# Altium project RK3588.PrjPcb (part 1 of 3)
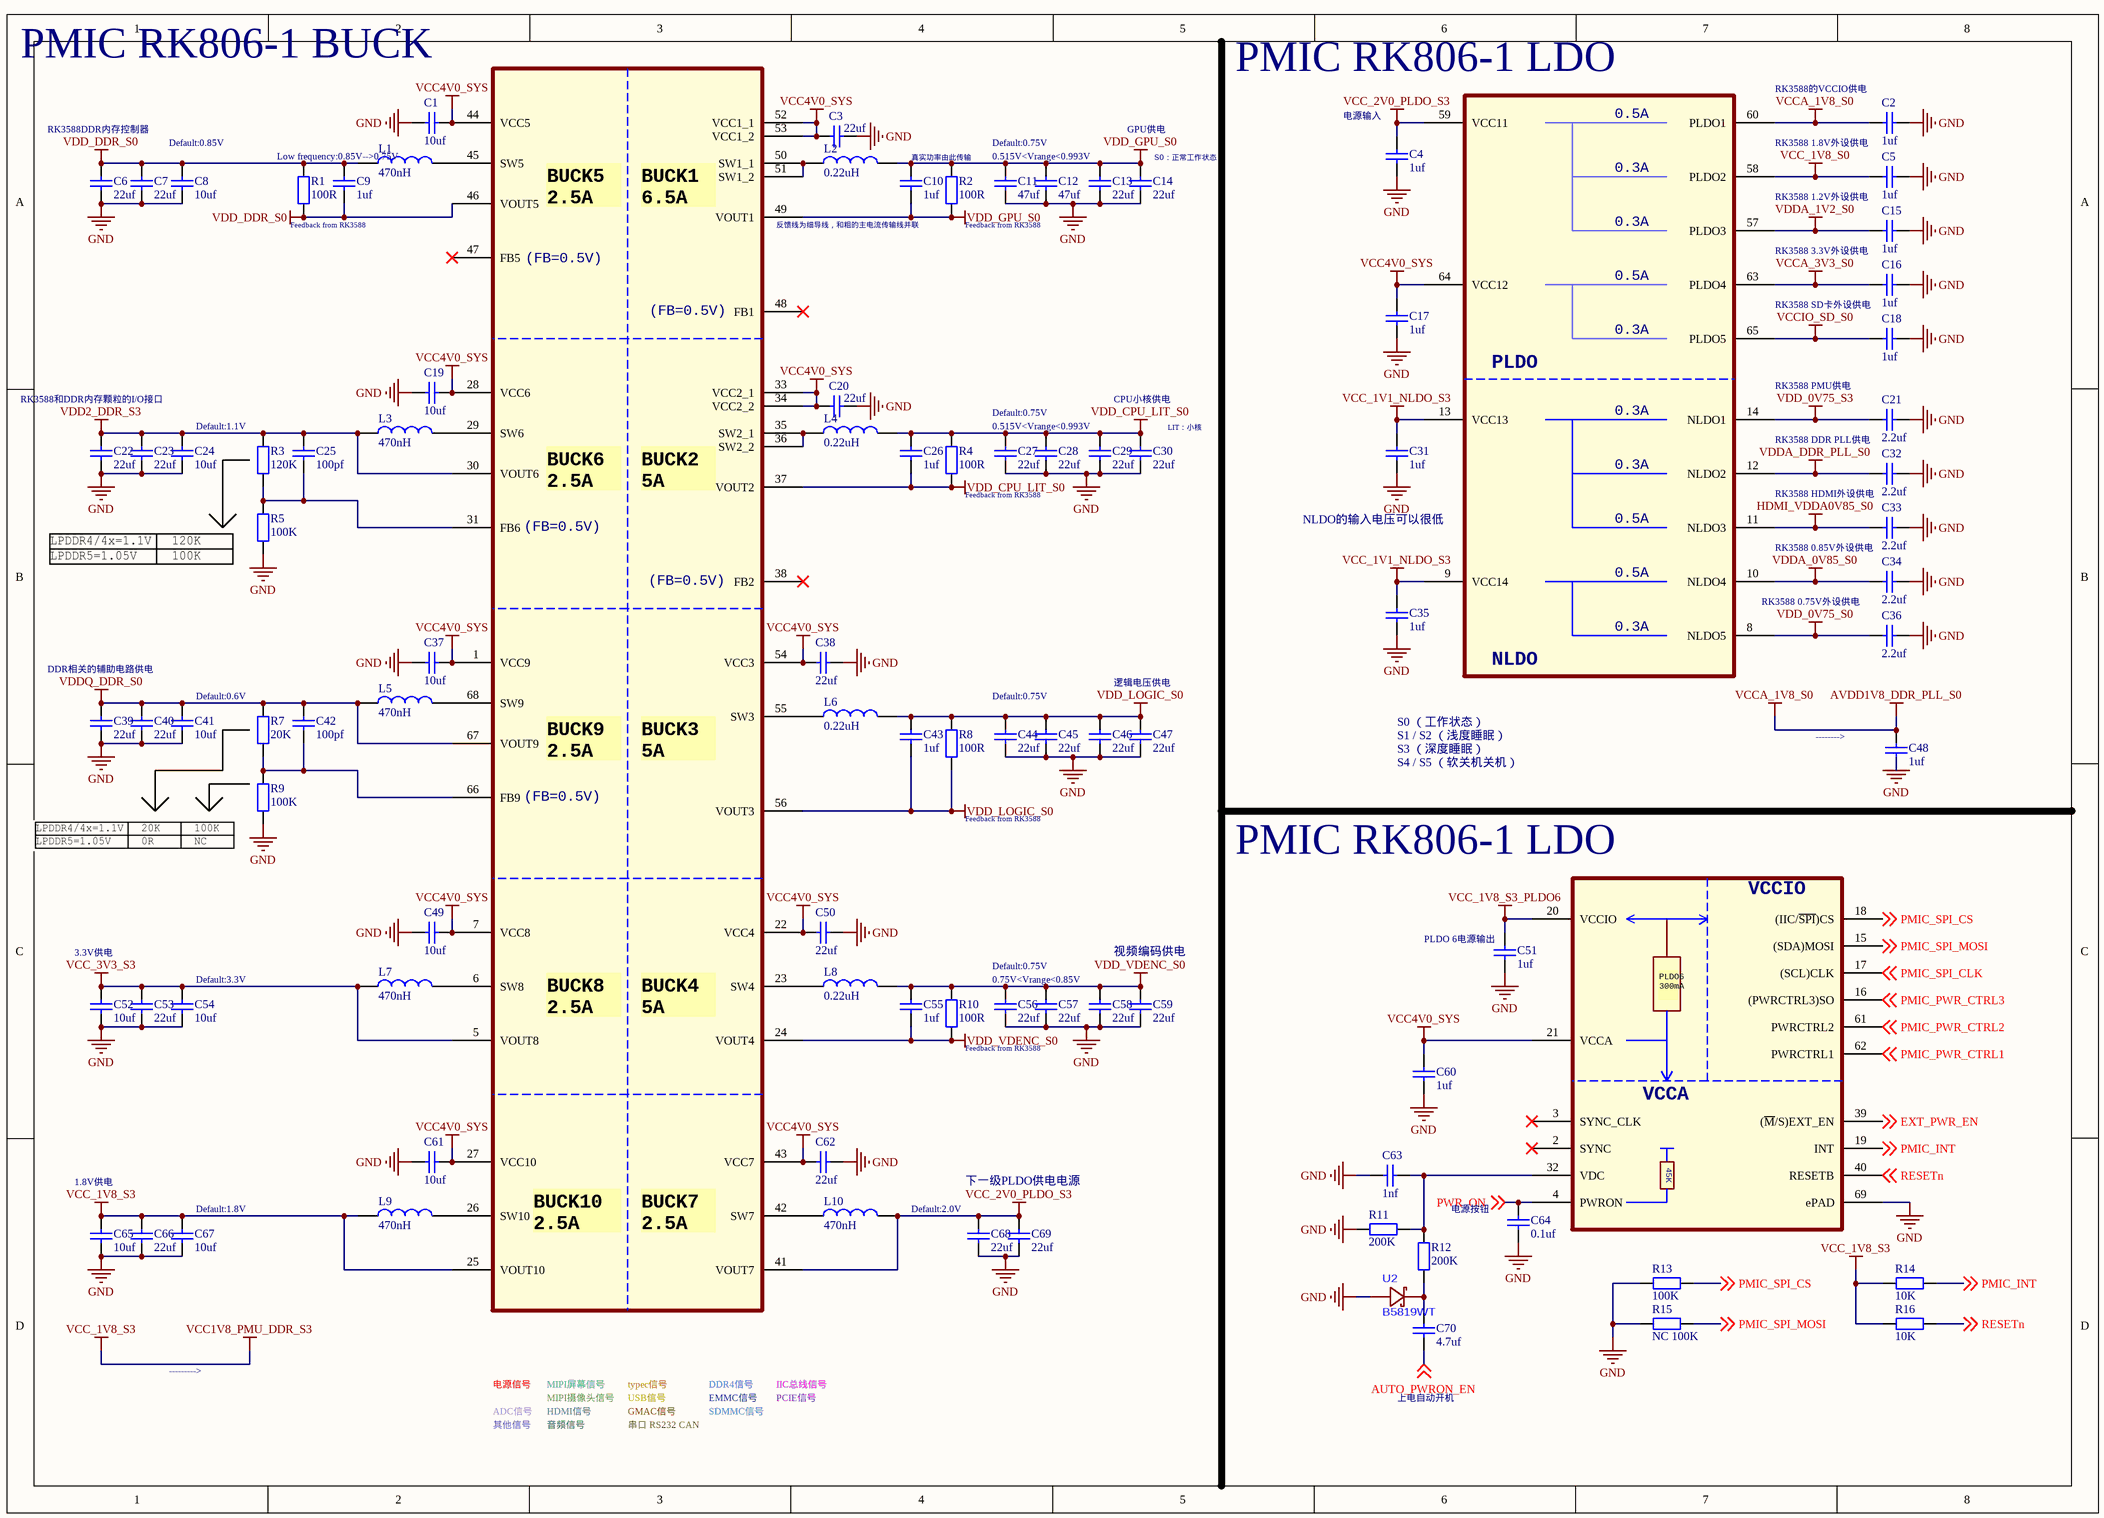
[diagram p0: 1.PMIC_1.SchDoc]
21 sheets, 570 parts. Net scope: global (net labels, ports and power ports of the same name join across sheets).
Board file: 0.PCB1.PcbDoc
Sheets:
  1.PMIC_1.SchDoc
  2.PMIC_2.SchDoc
  3.RK3588_POWER.SchDoc
  4.RK3588_GND.SchDoc
  5.RK3588_OSC_PLL_PMUIO1.SchDoc
  6.RK3588_PMUIO2.SchDoc
  7.RK3588_DDR_Controler.SchDoc
  8.RK3588_EMMCIO_VCCIO2.SchDoc
  9.RK3588_USB_Controler.SchDoc
  10.RK3588_VCCIO1_VCCIO3_SARADC.SchDoc
  11.RK3588_MIPI_D_C_PHY0_1.SchDoc
  12.RK3588_MIPI_CSI_HDMI2.1_HDMI.SchDoc
  13.RK3588_PCIE2.0_PCIE3.0.SchDoc
  14.RK3588_VCCIO4.SchDoc
  15.RK3588_VCCIO5.SchDoc
  16.RK3588_VCCIO6.SchDoc
  17.LPDDR4_LPDDR4x_1.SchDoc
  18.LPDDR4_LPDDR4x_2.SchDoc
  19.EMMC_FLASH.SchDoc
  20.BTB.SchDoc
  21.RK3588_CONFIG.SchDoc

## Sheet 1.PMIC_1.SchDoc
size A3; SheetNumber: 1; SheetTotal: 21

### Parts
C1  10uf  [C0603_L]
C2  1uf  [C0402_L]
C3  22uf  [C0603_L]
C4  1uf  [C0402_L]
C5  1uf  [C0402_L]
C6  22uf  [C0603_L]
C7  22uf  [C0603_L]
C8  10uf  [C0402_L]
C9  1uf  [C0402_L]
C10  1uf  [C0402_L]
C11  47uf  [C0805_L]
C12  47uf  [C0805_L]
C13  22uf  [C0603_L]
C14  22uf  [C0603_L]
C15  1uf  [C0402_L]
C16  1uf  [C0402_L]
C17  1uf  [C0402_L]
C18  1uf  [C0402_L]
C19  10uf  [C0603_L]
C20  22uf  [C0603_L]
C21  2.2uf  [C0402_L]
C22  22uf  [C0603_L]
C23  22uf  [C0603_L]
C24  10uf  [C0402_L]
C25  100pf  [C0402_L]
C26  1uf  [C0402_L]
C27  22uf  [C0603_L]
C28  22uf  [C0603_L]
C29  22uf  [C0603_L]
C30  22uf  [C0603_L]
C31  1uf  [C0402_L]
C32  2.2uf  [C0402_L]
C33  2.2uf  [C0402_L]
C34  2.2uf  [C0402_L]
C35  1uf  [C0402_L]
C36  2.2uf  [C0402_L]
C37  10uf  [C0603_L]
C38  22uf  [C0603_L]
C39  22uf  [C0603_L]
C40  22uf  [C0603_L]
C41  10uf  [C0402_L]
C42  100pf  [C0402_L]
C43  1uf  [C0402_L]
C44  22uf  [C0805_L]
C45  22uf  [C0805_L]
C46  22uf  [C0603_L]
C47  22uf  [C0603_L]
C48  1uf  [C0402_L]
C49  10uf  [C0603_L]
C50  22uf  [C0603_L]
C51  1uf  [C0402_L]
C52  10uf  [C0603_L]
C53  22uf  [C0603_L]
C54  10uf  [C0402_L]
C55  1uf  [C0402_L]
C56  22uf  [C0805_L]
C57  22uf  [C0805_L]
C58  22uf  [C0603_L]
C59  22uf  [C0603_L]
C60  1uf  [C0402_L]
C61  10uf  [C0603_L]
C62  22uf  [C0603_L]
C63  1nf  [C0402_L]
C64  0.1uf  [C0402_L]
C65  10uf  [C0603_L]
C66  22uf  [C0603_L]
C67  10uf  [C0402_L]
C68  22uf  [C0603_L]
C69  22uf  [C0603_L]
C70  4.7uf  [C0402_L]
L1  470nH  [L0805]
L2  0.22uH  [L0805]
L3  470nH  [L0805]
L4  0.22uH  [L0805]
L5  470nH  [L0805]
L6  0.22uH  [L0805]
L7  470nH  [L0805]
L8  0.22uH  [L0805]
L9  470nH  [L0805]
L10  470nH  [L0805]
R1  100R  [R0402_L]
R2  100R  [R0402_L]
R3  120K  [R0402_L]
R4  100R  [R0402_L]
R5  100K  [R0402_L]
R7  20K  [R0402_L]
R8  100R  [R0402_L]
R9  100K  [R0402_L]
R10  100R  [R0402_L]
R11  200K  [R0402_L]
R12  200K  [R0402_L]
R13  100K  [R0402_L]
R14  10K  [R0402_L]
R15  NC 100K  [R0402_L]
R16  10K  [R0402_L]
U1  PMIC_RK806  [QFN68_7R00X7R00X0R80_T]  (value not drawn)  (parts A,B,C of 3)
U2  B5819WT  [SOD-523_L1.2-W0.8-LS1.6-RD]

### Nets
AVDD1V8_DDR_PLL_S0: C2.2 C48.1 U1.60(PLDO1)  [also labelled VCCA_1V8_S0]
GND: C1.2 C2.1 C3.2 C4.1 C5.1 C6.1 C7.1 C8.1 C11.1 C12.1 C13.1 C14.1 C15.1 C16.1 C17.1 C18.1 C19.2 C20.2 C21.1 C22.1 C23.1 C24.1 C27.1 C28.1 C29.1 C30.1 C31.1 C32.1 C33.1 C34.1 C35.1 C36.1 C37.2 C38.2 C39.1 C40.1 C41.1 C44.1 C45.1 C46.1 C47.1 C48.2 C49.2 C50.2 C51.1 C52.1 C53.1 C54.1 C56.1 C57.1 C58.1 C59.1 C60.1 C61.2 C62.2 C63.1 C64.1 C65.1 C66.1 C67.1 C68.1 C69.1 R5.1 R9.1 R11.1 R13.1 R15.1 U1.69(ePAD) U2.2(A)
HDMI_VDDA0V85_S0: C33.2 U1.11(NLDO3)
VCC1V8_PMU_DDR_S3: C65.2 C66.2 C67.2 L9.2 R14.1 R16.1 U1.25(VOUT10)  [also labelled VCC_1V8_S3]
VCC4V0_SYS: C1.1 C3.1 C17.2 C19.1 C20.1 C37.1 C38.1 C49.1 C50.1 C60.2 C61.1 C62.1 U1.1(VCC9) U1.7(VCC8) U1.21(VCCA) U1.22(VCC4) U1.27(VCC10) U1.28(VCC6) U1.33(VCC2_1) U1.34(VCC2_2) U1.43(VCC7) U1.44(VCC5) U1.52(VCC1_1) U1.53(VCC1_2) U1.54(VCC3) U1.64(VCC12)
VCC_1V1_NLDO_S3: C31.2 C35.2 U1.9(VCC14) U1.13(VCC13)
VCC_1V8_S0: C5.2 U1.58(PLDO2)
VCC_1V8_S3_PLDO6: C51.2 U1.20(VCCIO)
VCC_2V0_PLDO_S3: C4.2 C68.2 C69.2 L10.2 U1.41(VOUT7) U1.59(VCC11)
VCC_3V3_S3: C52.2 C53.2 C54.2 L7.2 U1.5(VOUT8)
VCCA_3V3_S0: C16.2 U1.63(PLDO4)
VCCIO_SD_S0: C18.2 U1.65(PLDO5)
VDD2_DDR_S3: C22.2 C23.2 C24.2 C25.2 L3.2 R3.2 U1.30(VOUT6)
VDD_0V75_S0: C36.2 U1.8(NLDO5)
VDD_0V75_S3: C21.2 U1.14(NLDO1)
VDD_CPU_LIT_S0: C26.1 C26.2 C27.2 C28.2 C29.2 C30.2 L4.2 R4.1 R4.2 U1.37(VOUT2)
VDD_DDR_S0: C6.2 C7.2 C8.2 C9.1 C9.2 L1.2 R1.1 R1.2 U1.46(VOUT5)
VDD_GPU_S0: C10.1 C10.2 C11.2 C12.2 C13.2 C14.2 L2.2 R2.1 R2.2 U1.49(VOUT1)
VDD_LOGIC_S0: C43.1 C43.2 C44.2 C45.2 C46.2 C47.2 L6.2 R8.1 R8.2 U1.56(VOUT3)
VDD_VDENC_S0: C55.1 C55.2 C56.2 C57.2 C58.2 C59.2 L8.2 R10.1 R10.2 U1.24(VOUT4)
VDDA_0V85_S0: C34.2 U1.10(NLDO4)
VDDA_1V2_S0: C15.2 U1.57(PLDO3)
VDDA_DDR_PLL_S0: C32.2 U1.12(NLDO2)
VDDQ_DDR_S0: C39.2 C40.2 C41.2 C42.2 L5.2 R7.2 U1.67(VOUT9)  [project net VDDQ_DDR]
AUTO_PWRON_EN: C70.2 ; off-sheet AUTO_PWRON_EN
EXT_PWR_EN: U1.39((~{M}/S)EXT_EN) ; off-sheet EXT_PWR_EN
PMIC_INT: R14.2 U1.19(INT) ; off-sheet PMIC_INT
PMIC_PWR_CTRL1: U1.62(PWRCTRL1) ; off-sheet PMIC_PWR_CTRL1
PMIC_PWR_CTRL2: U1.61(PWRCTRL2) ; off-sheet PMIC_PWR_CTRL2
PMIC_PWR_CTRL3: U1.16((PWRCTRL3)SO) ; off-sheet PMIC_PWR_CTRL3
PMIC_SPI_CLK: U1.17((SCL)CLK) ; off-sheet PMIC_SPI_CLK
PMIC_SPI_CS: R13.2 U1.18((IIC/~{SPI})CS) ; off-sheet PMIC_SPI_CS
PMIC_SPI_MOSI: R15.2 U1.15((SDA)MOSI) ; off-sheet PMIC_SPI_MOSI
PWR_ON: C64.2 U1.4(PWRON) ; off-sheet PWR_ON
RESETn: R16.2 U1.40(RESETB) ; off-sheet RESETn
NetC25_1: C25.1 R3.1 R5.2 U1.31(FB6)
NetC42_1: C42.1 R7.1 R9.2 U1.66(FB9)
NetC63_2: C63.2 R11.2 R12.2 U1.32(VDC)
NetC70_1: C70.1 R12.1 U2.1(C)
NetL1_1: L1.1 U1.45(SW5)
NetL2_1: L2.1 U1.50(SW1_1) U1.51(SW1_2)
NetL3_1: L3.1 U1.29(SW6)
NetL4_1: L4.1 U1.35(SW2_1) U1.36(SW2_2)
NetL5_1: L5.1 U1.68(SW9)
NetL6_1: L6.1 U1.55(SW3)
NetL7_1: L7.1 U1.6(SW8)
NetL8_1: L8.1 U1.23(SW4)
NetL9_1: L9.1 U1.26(SW10)
NetL10_1: L10.1 U1.42(SW7)

Not connected (* = marked no-connect by the designer): U1 2(SYNC)* 3(SYNC_CLK)* 38(FB2)* 47(FB5)* 48(FB1)*

### Notes on the sheet
- PMIC RK806-1 BUCK
- (near U1) PMIC RK806-1 LDO
- (near C4) 电源输入
- RK3588的VCCIO供电
- RK3588DDR内存控制器
- Default:0.85V
- Low frequency:0.85V-->0.75V
- 真实功率由此传输
- Default:0.75V
- 0.515V<Vrange<0.993V
- GPU供电
- (near C14) S0​：正常工作状态
- RK3588 1.8V外设供电
- (near R1) Feedback from RK3588
- (near U1) 反馈线为细导线，和粗的主电流传输线并联
- Feedback from RK3588
- RK3588 1.2V外设供电
- RK3588 3.3V外设供电
- RK3588 SD卡外设供电
- RK3588 PMU供电
- RK3588和DDR内存颗粒的I/O接口
- Default:1.1V
- CPU小核供电
- (near C30) LIT：小核
- RK3588 DDR PLL供电
- NLDO的输入电压可以很低
- RK3588 HDMI外设供电
- RK3588 0.85V外设供电
- (near U1) RK3588 0.75V外设供电
- DDR相关的辅助电路供电
- Default:0.6V
- 逻辑电压供电
- S0 （工作状态）
- S1 / S2 （浅度睡眠）
- S3 （深度睡眠）
- S4 / S5 （软关机关机）
- (near C48) -------->
- PMIC RK806-1 LDO
- 3.3V供电
- (near C54) Default:3.3V
- 0.75V<Vrange<0.85V
- 视频编码供电
- (near C51) PLDO 6电源输出
- 1.8V供电
- 下一级PLDO供电电源
- (near C67) Default:1.8V
- (near C68) Default:2.0V
- 电源按钮
- --------->
- 电源信号
- MIPI屏幕信号
- MIPI摄像头信号
- typec信号
- USB信号
- DDR4信号
- EMMC信号
- PCIE信号
- IIC总线信号
- 上电自动开机
- 其他信号
- ADC信号
- 音频信号
- HDMI信号
- 串口 RS232 CAN
- GMAC信号
- SDMMC信号
- (in symbol PMIC_RK806, part A) BUCK5 / 2.5A; BUCK1 / 6.5A; (FB=0.5V); BUCK6 / 2.5A; BUCK2 / 5A; BUCK9 / 2.5A; BUCK3 / 5A; BUCK8 / 2.5A; BUCK4 / 5A; BUCK10 / 2.5A; BUCK7 / 2.5A
- (in symbol PMIC_RK806, part B) 0.5A; 0.3A; PLDO; NLDO
- (in symbol PMIC_RK806, part C) PLDO6 / 300mA; 45K

### Library data of the parts
C1-C70 = C: 贴片电容/MLCC电容
L1-L10 = L: 贴片小功率电感
R1-R5 R7-R16 = R: 贴片电阻

## Sheet 2.PMIC_2.SchDoc
size A4; SheetNumber: 2; SheetTotal: 21
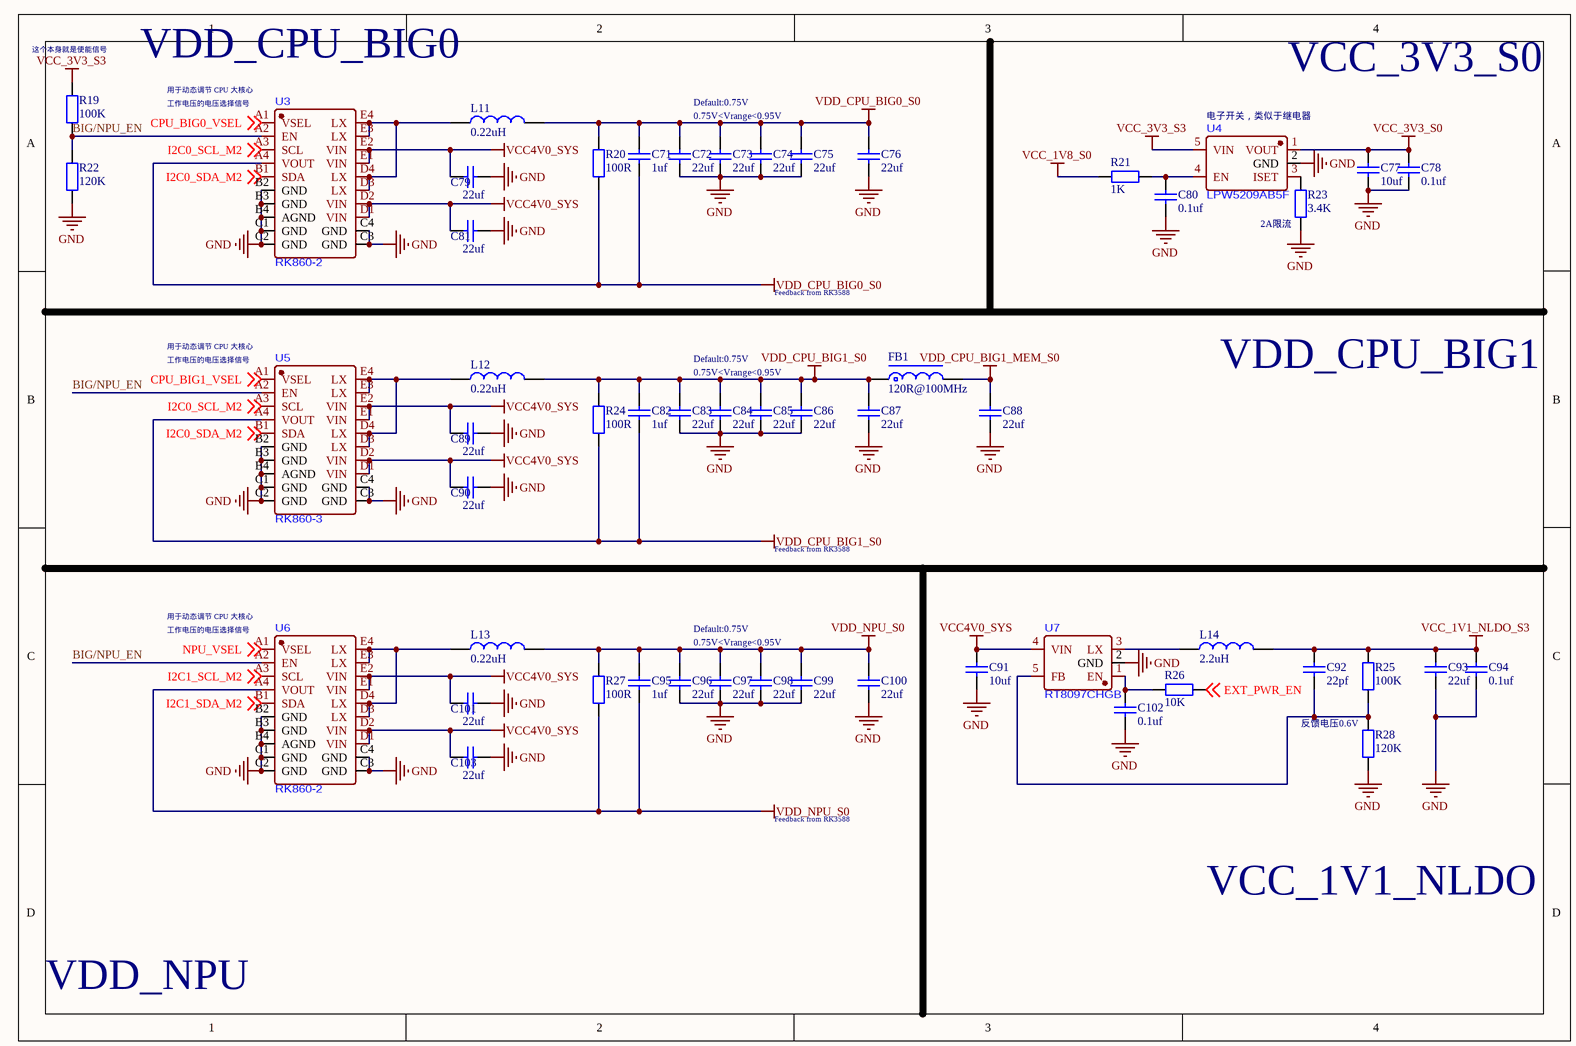
[diagram p1: 2.PMIC_2.SchDoc]

### Parts
C71  1uf  [C0402_L]
C72  22uf  [C0603_L]
C73  22uf  [C0603_L]
C74  22uf  [C0603_L]
C75  22uf  [C0603_L]
C76  22uf  [C0603_L]
C77  10uf  [C0402_L]
C78  0.1uf  [C0402_L]
C79  22uf  [C0603_L]
C80  0.1uf  [C0402_L]
C81  22uf  [C0603_L]
C82  1uf  [C0402_L]
C83  22uf  [C0603_L]
C84  22uf  [C0603_L]
C85  22uf  [C0603_L]
C86  22uf  [C0603_L]
C87  22uf  [C0603_L]
C88  22uf  [C0603_L]
C89  22uf  [C0603_L]
C90  22uf  [C0603_L]
C91  10uf  [C0402_L]
C92  22pf  [C0402_L]
C93  22uf  [C0603_L]
C94  0.1uf  [C0402_L]
C95  1uf  [C0402_L]
C96  22uf  [C0603_L]
C97  22uf  [C0603_L]
C98  22uf  [C0603_L]
C99  22uf  [C0603_L]
C100  22uf  [C0603_L]
C101  22uf  [C0603_L]
C102  0.1uf  [C0402_L]
C103  22uf  [C0603_L]
FB1  120R@100MHz  [FB0402]
L11  0.22uH  [L0805]
L12  0.22uH  [L0805]
L13  0.22uH  [L0805]
L14  2.2uH  [L0805]
R19  100K  [R0402_L]
R20  100R  [R0402_L]
R21  1K  [R0402_L]
R22  120K  [R0402_L]
R23  3.4K  [R0402_L]
R24  100R  [R0402_L]
R25  100K  [R0402_L]
R26  10K  [R0402_L]
R27  100R  [R0402_L]
R28  120K  [R0402_L]
U3  RK860-2  [WLCSP-20_L2.0-W1.6-R5-C4-P0.40-TL]
U4  LPW5209AB5F  [SOT-23-5_L3.0-W1.7-P0.95-LS2.8-BL]
U5  RK860-3  [WLCSP-20_L2.0-W1.6-R5-C4-P0.40-TL]
U6  RK860-2  [WLCSP-20_L2.0-W1.6-R5-C4-P0.40-TL]
U7  RT8097CHGB  [SOT-23-5_L3.0-W1.7-P0.95-LS2.8-BR]

### Nets
GND: C72.1 C73.1 C74.1 C75.1 C76.1 C77.1 C78.1 C79.1 C80.1 C81.1 C83.1 C84.1 C85.1 C86.1 C87.1 C88.1 C89.1 C90.1 C91.2 C93.1 C94.1 C96.1 C97.1 C98.1 C99.1 C100.1 C101.1 C102.1 C103.1 R22.1 R23.1 R28.1 U3.B2(GND) U3.B3(GND) U3.B4(AGND) U3.C1(GND) U3.C2(GND) U3.C3(GND) U3.C4(GND) U4.2(GND) U5.B2(GND) U5.B3(GND) U5.B4(AGND) U5.C1(GND) U5.C2(GND) U5.C3(GND) U5.C4(GND) U6.B2(GND) U6.B3(GND) U6.B4(AGND) U6.C1(GND) U6.C2(GND) U6.C3(GND) U6.C4(GND) U7.2(GND)
VCC4V0_SYS: C79.2 C81.2 C89.2 C90.2 C91.1 C101.2 C103.2 U3.D1(VIN) U3.D2(VIN) U3.E1(VIN) U3.E2(VIN) U5.D1(VIN) U5.D2(VIN) U5.E1(VIN) U5.E2(VIN) U6.D1(VIN) U6.D2(VIN) U6.E1(VIN) U6.E2(VIN) U7.4(VIN)
VCC_1V1_NLDO_S3: C92.2 C93.2 C94.2 L14.2 R25.2
VCC_1V8_S0: R21.1
VCC_3V3_S0: C77.2 C78.2 U4.1(VOUT)
VCC_3V3_S3: R19.2 U4.5(VIN)
VDD_CPU_BIG0_S0: C71.1 C71.2 C72.2 C73.2 C74.2 C75.2 C76.2 L11.2 R20.1 R20.2 U3.A4(VOUT)
VDD_CPU_BIG1_MEM_S0: C88.2 FB1.2
VDD_CPU_BIG1_S0: C82.1 C82.2 C83.2 C84.2 C85.2 C86.2 C87.2 FB1.1 L12.2 R24.1 R24.2 U5.A4(VOUT)
VDD_NPU_S0: C95.1 C95.2 C96.2 C97.2 C98.2 C99.2 C100.2 L13.2 R27.1 R27.2 U6.A4(VOUT)
BIG/NPU_EN: R19.1 R22.2 U3.A2(EN) U5.A2(EN) U6.A2(EN)
CPU_BIG0_VSEL: U3.A1(VSEL) ; off-sheet CPU_BIG0_VSEL
CPU_BIG1_VSEL: U5.A1(VSEL) ; off-sheet CPU_BIG1_VSEL
EXT_PWR_EN: R26.2 ; off-sheet EXT_PWR_EN
I2C0_SCL_M2: U3.A3(SCL) U5.A3(SCL) ; off-sheet I2C0_SCL_M2
I2C0_SDA_M2: U3.B1(SDA) U5.B1(SDA) ; off-sheet I2C0_SDA_M2
I2C1_SCL_M2: U6.A3(SCL) ; off-sheet I2C1_SCL_M2
I2C1_SDA_M2: U6.B1(SDA) ; off-sheet I2C1_SDA_M2
NPU_VSEL: U6.A1(VSEL) ; off-sheet NPU_VSEL
NetC80_2: C80.2 R21.2 U4.4(EN)
NetC92_1: C92.1 R25.1 R28.2 U7.5(FB)
NetC102_2: C102.2 R26.1 U7.1(EN)
NetL11_1: L11.1 U3.D3(LX) U3.D4(LX) U3.E3(LX) U3.E4(LX)
NetL12_1: L12.1 U5.D3(LX) U5.D4(LX) U5.E3(LX) U5.E4(LX)
NetL13_1: L13.1 U6.D3(LX) U6.D4(LX) U6.E3(LX) U6.E4(LX)
NetL14_1: L14.1 U7.3(LX)
NetR23_2: R23.2 U4.3(ISET)

### Notes on the sheet
- (near R19) 这个本身就是使能信号
- VDD_CPU_BIG0
- 用于动态调节 CPU 大核心
- 工作电压的电压选择信号
- Default:0.75V
- 0.75V<Vrange<0.95V
- (near U4) 电子开关，类似于继电器
- VCC_3V3_S0
- (near R23) 2A限流
- Feedback from RK3588
- VDD_CPU_BIG1
- 反馈电压0.6V
- VCC_1V1_NLDO
- VDD_NPU

### Library data of the parts
C71-C103 = C: 贴片电容/MLCC电容
FB1 = FB: 贴片磁珠
L11-L14 = L: 贴片小功率电感
R19-R28 = R: 贴片电阻

## Sheet 3.RK3588_POWER.SchDoc
size A4; SheetNumber: 3; SheetTotal: 21
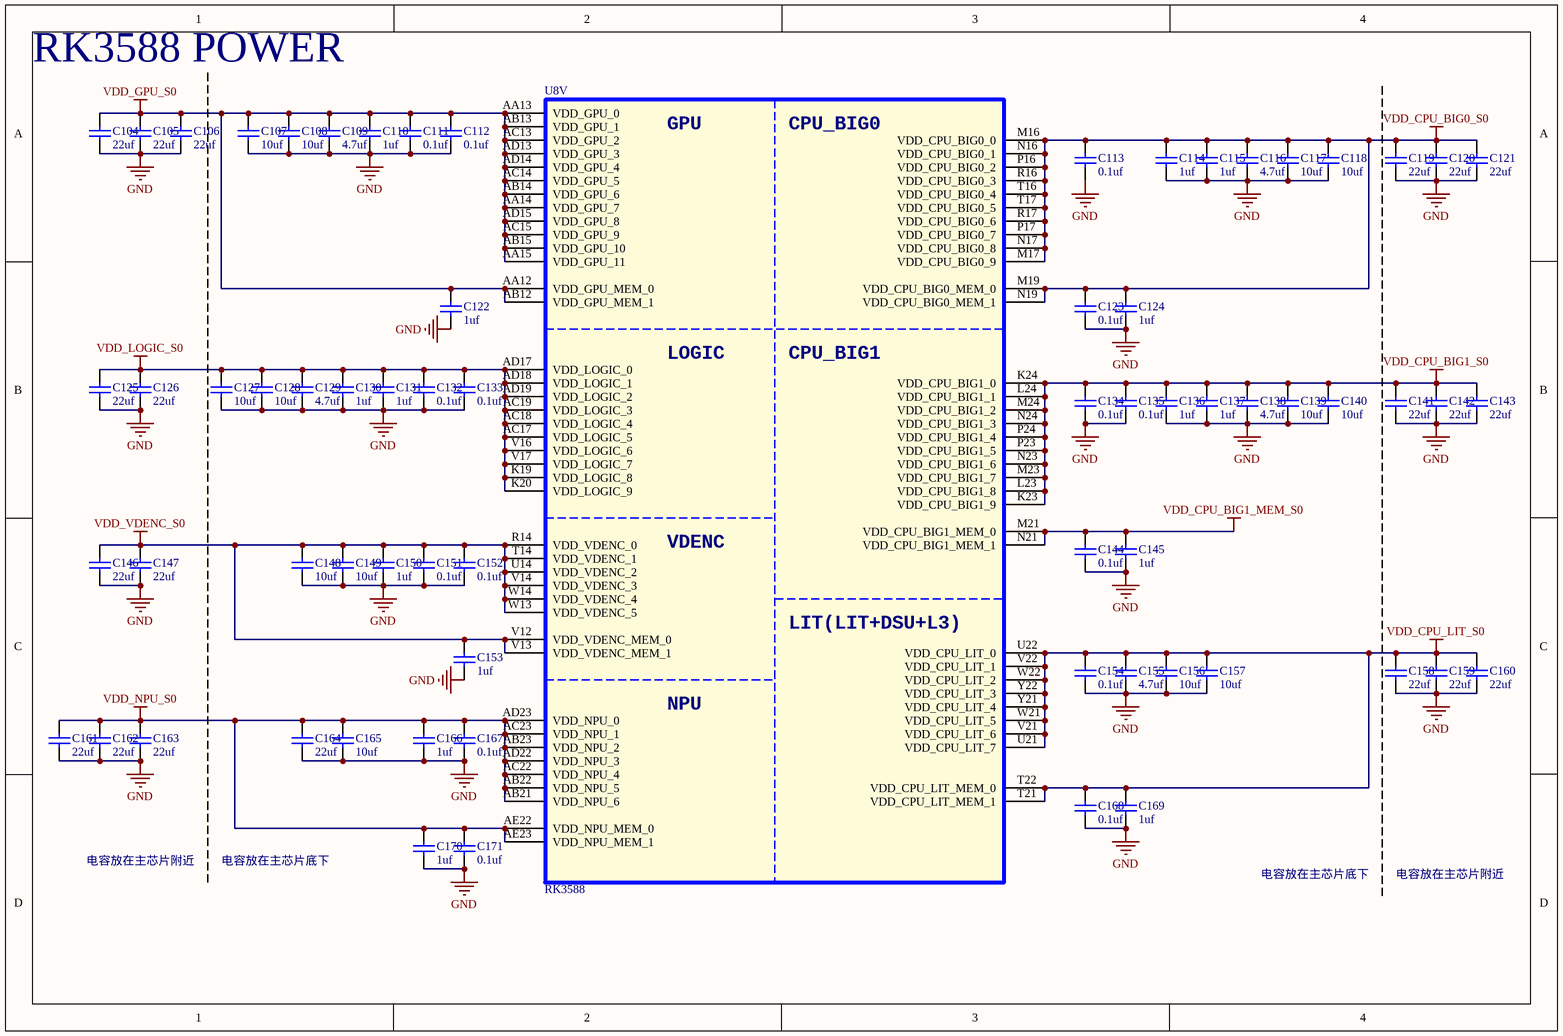
[diagram p2: 3.RK3588_POWER.SchDoc]

### Parts
C104  22uf  [C0603_L]
C105  22uf  [C0603_L]
C106  22uf  [C0603_L]
C107  10uf  [C0402_L]
C108  10uf  [C0402_L]
C109  4.7uf  [C0402_L]
C110  1uf  [C0201_L]
C111  0.1uf  [C0201_L]
C112  0.1uf  [C0201_L]
C113  0.1uf  [C0201_L]
C114  1uf  [C0201_L]
C115  1uf  [C0201_L]
C116  4.7uf  [C0201_L]
C117  10uf  [C0402_L]
C118  10uf  [C0402_L]
C119  22uf  [C0603_L]
C120  22uf  [C0603_L]
C121  22uf  [C0603_L]
C122  1uf  [C0201_L]
C123  0.1uf  [C0201_L]
C124  1uf  [C0201_L]
C125  22uf  [C0603_L]
C126  22uf  [C0603_L]
C127  10uf  [C0402_L]
C128  10uf  [C0402_L]
C129  4.7uf  [C0402_L]
C130  1uf  [C0201_L]
C131  1uf  [C0201_L]
C132  0.1uf  [C0201_L]
C133  0.1uf  [C0201_L]
C134  0.1uf  [C0201_L]
C135  0.1uf  [C0201_L]
C136  1uf  [C0201_L]
C137  1uf  [C0201_L]
C138  4.7uf  [C0402_L]
C139  10uf  [C0402_L]
C140  10uf  [C0402_L]
C141  22uf  [C0603_L]
C142  22uf  [C0603_L]
C143  22uf  [C0603_L]
C144  0.1uf  [C0201_L]
C145  1uf  [C0201_L]
C146  22uf  [C0603_L]
C147  22uf  [C0603_L]
C148  10uf  [C0402_L]
C149  10uf  [C0402_L]
C150  1uf  [C0201_L]
C151  0.1uf  [C0201_L]
C152  0.1uf  [C0201_L]
C153  1uf  [C0201_L]
C154  0.1uf  [C0201_L]
C155  4.7uf  [C0402_L]
C156  10uf  [C0402_L]
C157  10uf  [C0402_L]
C158  22uf  [C0603_L]
C159  22uf  [C0603_L]
C160  22uf  [C0603_L]
C161  22uf  [C0603_L]
C162  22uf  [C0603_L]
C163  22uf  [C0603_L]
C164  22uf  [C0402_L]
C165  10uf  [C0402_L]
C166  1uf  [C0201_L]
C167  0.1uf  [C0201_L]
C168  0.1uf  [C0201_L]
C169  1uf  [C0201_L]
C170  1uf  [C0201_L]
C171  0.1uf  [C0201_L]
U8  RK3588  [BGA1088_23R00X23R00X2R00]  (part V of 26)

### Nets
GND: C104.1 C105.1 C106.1 C107.1 C108.1 C109.1 C110.1 C111.1 C112.1 C113.1 C114.1 C115.1 C116.1 C117.1 C118.1 C119.1 C120.1 C121.1 C122.1 C123.1 C124.1 C125.1 C126.1 C127.1 C128.1 C129.1 C130.1 C131.1 C132.1 C133.1 C134.1 C135.1 C136.1 C137.1 C138.1 C139.1 C140.1 C141.1 C142.1 C143.1 C144.1 C145.1 C146.1 C147.1 C148.1 C149.1 C150.1 C151.1 C152.1 C153.1 C154.1 C155.1 C156.1 C157.1 C158.1 C159.1 C160.1 C161.1 C162.1 C163.1 C164.1 C165.1 C166.1 C167.1 C168.1 C169.1 C170.1 C171.1
VDD_CPU_BIG0_S0: C113.2 C114.2 C115.2 C116.2 C117.2 C118.2 C119.2 C120.2 C121.2 C123.2 C124.2 U8.M16(VDD_CPU_BIG0_0) U8.M17(VDD_CPU_BIG0_9) U8.M19(VDD_CPU_BIG0_MEM_0) U8.N16(VDD_CPU_BIG0_1) U8.N17(VDD_CPU_BIG0_8) U8.N19(VDD_CPU_BIG0_MEM_1) U8.P16(VDD_CPU_BIG0_2) U8.P17(VDD_CPU_BIG0_7) U8.R16(VDD_CPU_BIG0_3) U8.R17(VDD_CPU_BIG0_6) U8.T16(VDD_CPU_BIG0_4) U8.T17(VDD_CPU_BIG0_5)
VDD_CPU_BIG1_MEM_S0: C144.2 C145.2 U8.M21(VDD_CPU_BIG1_MEM_0) U8.N21(VDD_CPU_BIG1_MEM_1)
VDD_CPU_BIG1_S0: C134.2 C135.2 C136.2 C137.2 C138.2 C139.2 C140.2 C141.2 C142.2 C143.2 U8.K23(VDD_CPU_BIG1_9) U8.K24(VDD_CPU_BIG1_0) U8.L23(VDD_CPU_BIG1_8) U8.L24(VDD_CPU_BIG1_1) U8.M23(VDD_CPU_BIG1_7) U8.M24(VDD_CPU_BIG1_2) U8.N23(VDD_CPU_BIG1_6) U8.N24(VDD_CPU_BIG1_3) U8.P23(VDD_CPU_BIG1_5) U8.P24(VDD_CPU_BIG1_4)
VDD_CPU_LIT_S0: C154.2 C155.2 C156.2 C157.2 C158.2 C159.2 C160.2 C168.2 C169.2 U8.T21(VDD_CPU_LIT_MEM_1) U8.T22(VDD_CPU_LIT_MEM_0) U8.U21(VDD_CPU_LIT_7) U8.U22(VDD_CPU_LIT_0) U8.V21(VDD_CPU_LIT_6) U8.V22(VDD_CPU_LIT_1) U8.W21(VDD_CPU_LIT_5) U8.W22(VDD_CPU_LIT_2) U8.Y21(VDD_CPU_LIT_4) U8.Y22(VDD_CPU_LIT_3)
VDD_GPU_S0: C104.2 C105.2 C106.2 C107.2 C108.2 C109.2 C110.2 C111.2 C112.2 C122.2 U8.AA12(VDD_GPU_MEM_0) U8.AA13(VDD_GPU_0) U8.AA14(VDD_GPU_7) U8.AA15(VDD_GPU_11) U8.AB12(VDD_GPU_MEM_1) U8.AB13(VDD_GPU_1) U8.AB14(VDD_GPU_6) U8.AB15(VDD_GPU_10) U8.AC13(VDD_GPU_2) U8.AC14(VDD_GPU_5) U8.AC15(VDD_GPU_9) U8.AD13(VDD_GPU_3) U8.AD14(VDD_GPU_4) U8.AD15(VDD_GPU_8)
VDD_LOGIC_S0: C125.2 C126.2 C127.2 C128.2 C129.2 C130.2 C131.2 C132.2 C133.2 U8.AC17(VDD_LOGIC_5) U8.AC18(VDD_LOGIC_4) U8.AC19(VDD_LOGIC_3) U8.AD17(VDD_LOGIC_0) U8.AD18(VDD_LOGIC_1) U8.AD19(VDD_LOGIC_2) U8.K19(VDD_LOGIC_8) U8.K20(VDD_LOGIC_9) U8.V16(VDD_LOGIC_6) U8.V17(VDD_LOGIC_7)
VDD_NPU_S0: C161.2 C162.2 C163.2 C164.2 C165.2 C166.2 C167.2 C170.2 C171.2 U8.AB21(VDD_NPU_6) U8.AB22(VDD_NPU_5) U8.AB23(VDD_NPU_2) U8.AC22(VDD_NPU_4) U8.AC23(VDD_NPU_1) U8.AD22(VDD_NPU_3) U8.AD23(VDD_NPU_0) U8.AE22(VDD_NPU_MEM_0) U8.AE23(VDD_NPU_MEM_1)
VDD_VDENC_S0: C146.2 C147.2 C148.2 C149.2 C150.2 C151.2 C152.2 C153.2 U8.R14(VDD_VDENC_0) U8.T14(VDD_VDENC_1) U8.U14(VDD_VDENC_2) U8.V12(VDD_VDENC_MEM_0) U8.V13(VDD_VDENC_MEM_1) U8.V14(VDD_VDENC_3) U8.W13(VDD_VDENC_5) U8.W14(VDD_VDENC_4)

### Notes on the sheet
- RK3588 POWER
- 电容放在主芯片附近
- 电容放在主芯片底下
- (in symbol SOC_RK3588, part V) GPU; CPU_BIG0; LOGIC; CPU_BIG1; VDENC; LIT(LIT+DSU+L3); NPU

### Library data of the parts
C104-C171 = C: 贴片电容/MLCC电容
U8 = SOC_RK3588: ROCKCHIP SOC

## Sheet 4.RK3588_GND.SchDoc
size A4; SheetNumber: 4; SheetTotal: 21
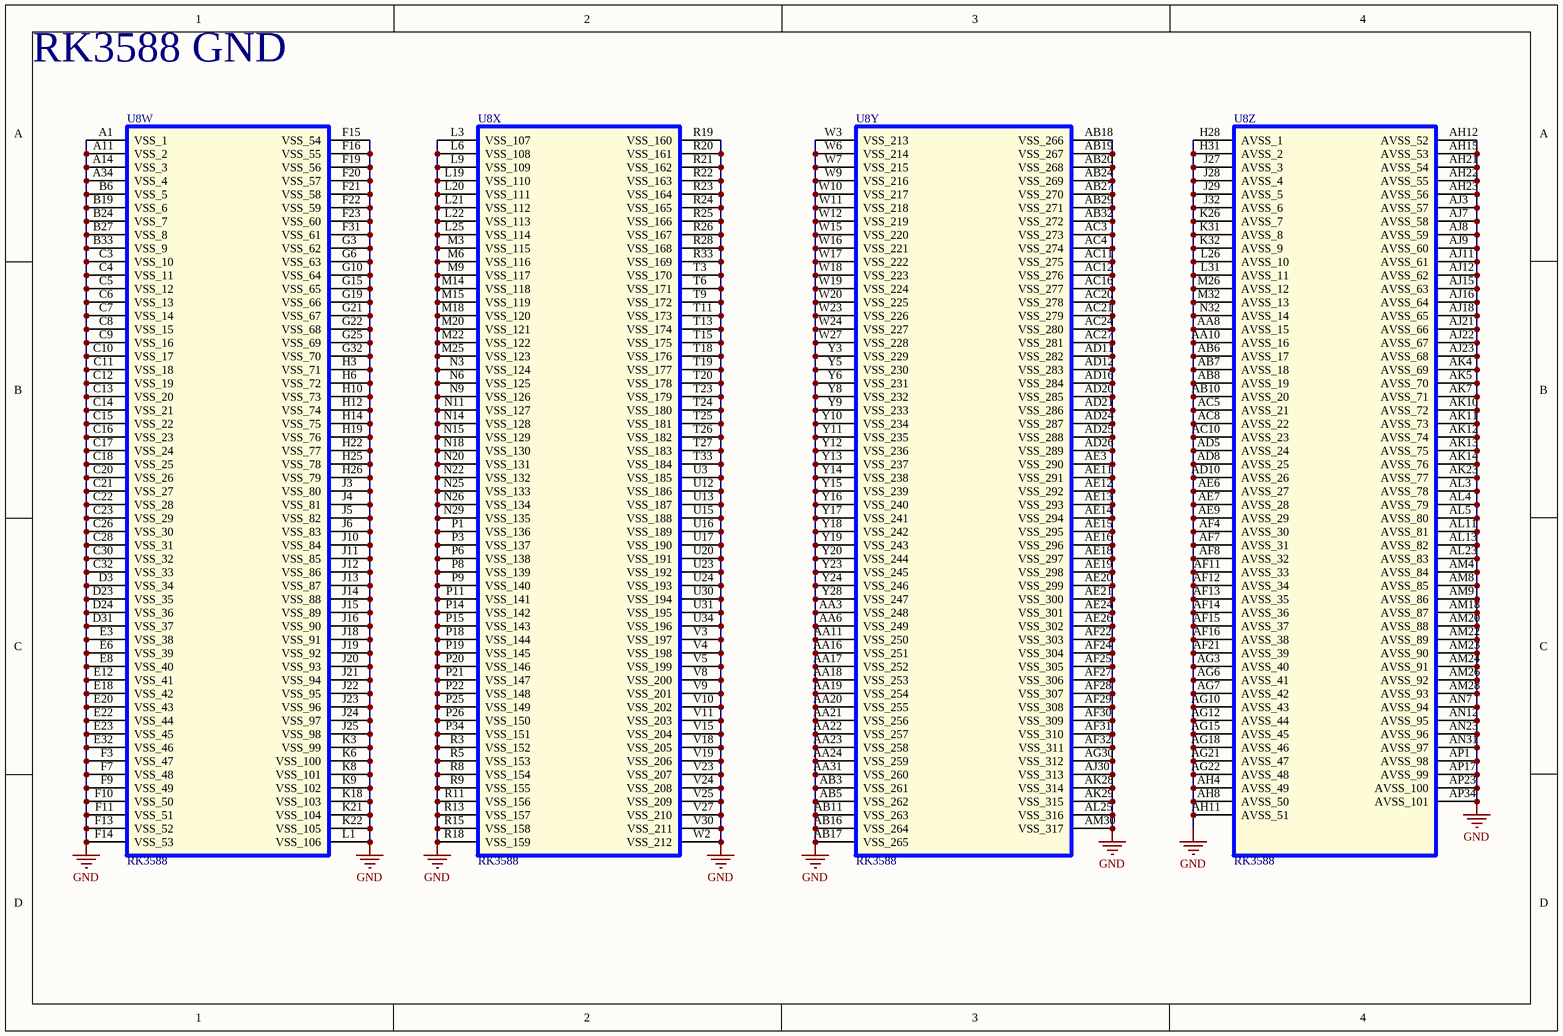
[diagram p3: 4.RK3588_GND.SchDoc]

### Parts
U8  RK3588  [BGA1088_23R00X23R00X2R00]  (parts W,X,Y,Z of 26)

### Nets
GND: U8.A1(VSS_1) U8.A11(VSS_2) U8.A14(VSS_3) U8.A34(VSS_4) U8.AA3(VSS_248) U8.AA6(VSS_249) U8.AA8(AVSS_15) U8.AA10(AVSS_16) U8.AA11(VSS_250) U8.AA16(VSS_251) U8.AA17(VSS_252) U8.AA18(VSS_253) U8.AA19(VSS_254) U8.AA20(VSS_255) U8.AA21(VSS_256) U8.AA22(VSS_257) U8.AA23(VSS_258) U8.AA24(VSS_259) U8.AA31(VSS_260) U8.AB3(VSS_261) U8.AB5(VSS_262) U8.AB6(AVSS_17) U8.AB7(AVSS_18) U8.AB8(AVSS_19) U8.AB10(AVSS_20) U8.AB11(VSS_263) U8.AB16(VSS_264) U8.AB17(VSS_265) U8.AB18(VSS_266) U8.AB19(VSS_267) U8.AB20(VSS_268) U8.AB24(VSS_269) U8.AB27(VSS_270) U8.AB29(VSS_271) U8.AB32(VSS_272) U8.AC3(VSS_273) U8.AC4(VSS_274) U8.AC5(AVSS_21) U8.AC8(AVSS_22) U8.AC10(AVSS_23) U8.AC11(VSS_275) U8.AC12(VSS_276) U8.AC16(VSS_277) U8.AC20(VSS_278) U8.AC21(VSS_279) U8.AC24(VSS_280) U8.AC27(VSS_281) U8.AD5(AVSS_24) U8.AD8(AVSS_25) U8.AD10(AVSS_26) U8.AD11(VSS_282) U8.AD12(VSS_283) U8.AD16(VSS_284) U8.AD20(VSS_285) U8.AD21(VSS_286) U8.AD24(VSS_287) U8.AD25(VSS_288) U8.AD26(VSS_289) U8.AE3(VSS_290) U8.AE6(AVSS_27) U8.AE7(AVSS_28) U8.AE9(AVSS_29) U8.AE11(VSS_291) U8.AE12(VSS_292) U8.AE13(VSS_293) U8.AE14(VSS_294) U8.AE15(VSS_295) U8.AE16(VSS_296) U8.AE18(VSS_297) U8.AE19(VSS_298) U8.AE20(VSS_299) U8.AE21(VSS_300) U8.AE24(VSS_301) U8.AE26(VSS_302) U8.AF4(AVSS_30) U8.AF7(AVSS_31) U8.AF8(AVSS_32) U8.AF11(AVSS_33) U8.AF12(AVSS_34) U8.AF13(AVSS_35) U8.AF14(AVSS_36) U8.AF15(AVSS_37) U8.AF16(AVSS_38) U8.AF21(AVSS_39) U8.AF22(VSS_303) U8.AF24(VSS_304) U8.AF25(VSS_305) U8.AF27(VSS_306) U8.AF28(VSS_307) U8.AF29(VSS_308) U8.AF30(VSS_309) U8.AF31(VSS_310) U8.AF32(VSS_311) U8.AG3(AVSS_40) U8.AG6(AVSS_41) U8.AG7(AVSS_42) U8.AG10(AVSS_43) U8.AG12(AVSS_44) U8.AG15(AVSS_45) U8.AG18(AVSS_46) U8.AG21(AVSS_47) U8.AG22(AVSS_48) U8.AG30(VSS_312) U8.AH4(AVSS_49) U8.AH8(AVSS_50) U8.AH11(AVSS_51) U8.AH12(AVSS_52) U8.AH15(AVSS_53) U8.AH21(AVSS_54) U8.AH22(AVSS_55) U8.AH23(AVSS_56) U8.AJ3(AVSS_57) U8.AJ7(AVSS_58) U8.AJ8(AVSS_59) U8.AJ9(AVSS_60) U8.AJ11(AVSS_61) U8.AJ12(AVSS_62) U8.AJ15(AVSS_63) U8.AJ16(AVSS_64) U8.AJ18(AVSS_65) U8.AJ21(AVSS_66) U8.AJ22(AVSS_67) U8.AJ23(AVSS_68) U8.AJ30(VSS_313) U8.AK4(AVSS_69) U8.AK5(AVSS_70) U8.AK7(AVSS_71) U8.AK10(AVSS_72) U8.AK11(AVSS_73) U8.AK12(AVSS_74) U8.AK13(AVSS_75) U8.AK14(AVSS_76) U8.AK23(AVSS_77) U8.AK28(VSS_314) U8.AK29(VSS_315) U8.AL3(AVSS_78) U8.AL4(AVSS_79) U8.AL5(AVSS_80) U8.AL11(AVSS_81) U8.AL13(AVSS_82) U8.AL23(AVSS_83) U8.AL25(VSS_316) U8.AM4(AVSS_84) U8.AM8(AVSS_85) U8.AM9(AVSS_86) U8.AM18(AVSS_87) U8.AM20(AVSS_88) U8.AM22(AVSS_89) U8.AM23(AVSS_90) U8.AM24(AVSS_91) U8.AM26(AVSS_92) U8.AM28(AVSS_93) U8.AM30(VSS_317) U8.AN7(AVSS_94) U8.AN12(AVSS_95) U8.AN23(AVSS_96) U8.AN31(AVSS_97) U8.AP1(AVSS_98) U8.AP17(AVSS_99) U8.AP23(AVSS_100) U8.AP34(AVSS_101) U8.B6(VSS_5) U8.B19(VSS_6) U8.B24(VSS_7) U8.B27(VSS_8) U8.B33(VSS_9) U8.C3(VSS_10) U8.C4(VSS_11) U8.C5(VSS_12) U8.C6(VSS_13) U8.C7(VSS_14) U8.C8(VSS_15) U8.C9(VSS_16) U8.C10(VSS_17) U8.C11(VSS_18) U8.C12(VSS_19) U8.C13(VSS_20) U8.C14(VSS_21) U8.C15(VSS_22) U8.C16(VSS_23) U8.C17(VSS_24) U8.C18(VSS_25) U8.C20(VSS_26) U8.C21(VSS_27) U8.C22(VSS_28) U8.C23(VSS_29) U8.C26(VSS_30) U8.C28(VSS_31) U8.C30(VSS_32) U8.C32(VSS_33) U8.D3(VSS_34) U8.D23(VSS_35) U8.D24(VSS_36) U8.D31(VSS_37) U8.E3(VSS_38) U8.E6(VSS_39) U8.E8(VSS_40) U8.E12(VSS_41) U8.E18(VSS_42) U8.E20(VSS_43) U8.E22(VSS_44) U8.E23(VSS_45) U8.E32(VSS_46) U8.F3(VSS_47) U8.F7(VSS_48) U8.F9(VSS_49) U8.F10(VSS_50) U8.F11(VSS_51) U8.F13(VSS_52) U8.F14(VSS_53) U8.F15(VSS_54) U8.F16(VSS_55) U8.F19(VSS_56) U8.F20(VSS_57) U8.F21(VSS_58) U8.F22(VSS_59) U8.F23(VSS_60) U8.F31(VSS_61) U8.G3(VSS_62) U8.G6(VSS_63) U8.G10(VSS_64) U8.G15(VSS_65) U8.G19(VSS_66) U8.G21(VSS_67) U8.G22(VSS_68) U8.G25(VSS_69) U8.G32(VSS_70) U8.H3(VSS_71) U8.H6(VSS_72) U8.H10(VSS_73) U8.H12(VSS_74) U8.H14(VSS_75) U8.H19(VSS_76) U8.H22(VSS_77) U8.H25(VSS_78) U8.H26(VSS_79) U8.H28(AVSS_1) U8.H31(AVSS_2) U8.J3(VSS_80) U8.J4(VSS_81) U8.J5(VSS_82) U8.J6(VSS_83) U8.J10(VSS_84) U8.J11(VSS_85) U8.J12(VSS_86) U8.J13(VSS_87) U8.J14(VSS_88) U8.J15(VSS_89) U8.J16(VSS_90) U8.J18(VSS_91) U8.J19(VSS_92) U8.J20(VSS_93) U8.J21(VSS_94) U8.J22(VSS_95) U8.J23(VSS_96) U8.J24(VSS_97) U8.J25(VSS_98) U8.J27(AVSS_3) U8.J28(AVSS_4) U8.J29(AVSS_5) U8.J32(AVSS_6) U8.K3(VSS_99) U8.K6(VSS_100) U8.K8(VSS_101) U8.K9(VSS_102) U8.K18(VSS_103) U8.K21(VSS_104) U8.K22(VSS_105) U8.K26(AVSS_7) U8.K31(AVSS_8) U8.K32(AVSS_9) U8.L1(VSS_106) U8.L3(VSS_107) U8.L6(VSS_108) U8.L9(VSS_109) U8.L19(VSS_110) U8.L20(VSS_111) U8.L21(VSS_112) U8.L22(VSS_113) U8.L25(VSS_114) U8.L26(AVSS_10) U8.L31(AVSS_11) U8.M3(VSS_115) U8.M6(VSS_116) U8.M9(VSS_117) U8.M14(VSS_118) U8.M15(VSS_119) U8.M18(VSS_120) U8.M20(VSS_121) U8.M22(VSS_122) U8.M25(VSS_123) U8.M26(AVSS_12) U8.M32(AVSS_13) U8.N3(VSS_124) U8.N6(VSS_125) U8.N9(VSS_126) U8.N11(VSS_127) U8.N14(VSS_128) U8.N15(VSS_129) U8.N18(VSS_130) U8.N20(VSS_131) U8.N22(VSS_132) U8.N25(VSS_133) U8.N26(VSS_134) U8.N29(VSS_135) U8.N32(AVSS_14) U8.P1(VSS_136) U8.P3(VSS_137) U8.P6(VSS_138) U8.P8(VSS_139) U8.P9(VSS_140) U8.P11(VSS_141) U8.P14(VSS_142) U8.P15(VSS_143) U8.P18(VSS_144) U8.P19(VSS_145) U8.P20(VSS_146) U8.P21(VSS_147) U8.P22(VSS_148) U8.P25(VSS_149) U8.P26(VSS_150) U8.P34(VSS_151) U8.R3(VSS_152) U8.R5(VSS_153) U8.R8(VSS_154) U8.R9(VSS_155) U8.R11(VSS_156) U8.R13(VSS_157) U8.R15(VSS_158) U8.R18(VSS_159) U8.R19(VSS_160) U8.R20(VSS_161) U8.R21(VSS_162) U8.R22(VSS_163) U8.R23(VSS_164) U8.R24(VSS_165) U8.R25(VSS_166) U8.R26(VSS_167) U8.R28(VSS_168) U8.R33(VSS_169) U8.T3(VSS_170) U8.T6(VSS_171) U8.T9(VSS_172) U8.T11(VSS_173) U8.T13(VSS_174) U8.T15(VSS_175) U8.T18(VSS_176) U8.T19(VSS_177) U8.T20(VSS_178) U8.T23(VSS_179) U8.T24(VSS_180) U8.T25(VSS_181) U8.T26(VSS_182) U8.T27(VSS_183) U8.T33(VSS_184) U8.U3(VSS_185) U8.U12(VSS_186) U8.U13(VSS_187) U8.U15(VSS_188) U8.U16(VSS_189) U8.U17(VSS_190) U8.U20(VSS_191) U8.U23(VSS_192) U8.U24(VSS_193) U8.U30(VSS_194) U8.U31(VSS_195) U8.U34(VSS_196) U8.V3(VSS_197) U8.V4(VSS_198) U8.V5(VSS_199) U8.V8(VSS_200) U8.V9(VSS_201) U8.V10(VSS_202) U8.V11(VSS_203) U8.V15(VSS_204) U8.V18(VSS_205) U8.V19(VSS_206) U8.V23(VSS_207) U8.V24(VSS_208) U8.V25(VSS_209) U8.V27(VSS_210) U8.V30(VSS_211) U8.W2(VSS_212) U8.W3(VSS_213) U8.W6(VSS_214) U8.W7(VSS_215) U8.W9(VSS_216) U8.W10(VSS_217) U8.W11(VSS_218) U8.W12(VSS_219) U8.W15(VSS_220) U8.W16(VSS_221) U8.W17(VSS_222) U8.W18(VSS_223) U8.W19(VSS_224) U8.W20(VSS_225) U8.W23(VSS_226) U8.W24(VSS_227) U8.W27(VSS_228) U8.Y3(VSS_229) U8.Y5(VSS_230) U8.Y6(VSS_231) U8.Y8(VSS_232) U8.Y9(VSS_233) U8.Y10(VSS_234) U8.Y11(VSS_235) U8.Y12(VSS_236) U8.Y13(VSS_237) U8.Y14(VSS_238) U8.Y15(VSS_239) U8.Y16(VSS_240) U8.Y17(VSS_241) U8.Y18(VSS_242) U8.Y19(VSS_243) U8.Y20(VSS_244) U8.Y23(VSS_245) U8.Y24(VSS_246) U8.Y28(VSS_247)

### Notes on the sheet
- RK3588 GND

### Library data of the parts
U8 = SOC_RK3588: ROCKCHIP SOC

## Sheet 5.RK3588_OSC_PLL_PMUIO1.SchDoc
size A4; SheetNumber: 5; SheetTotal: 21
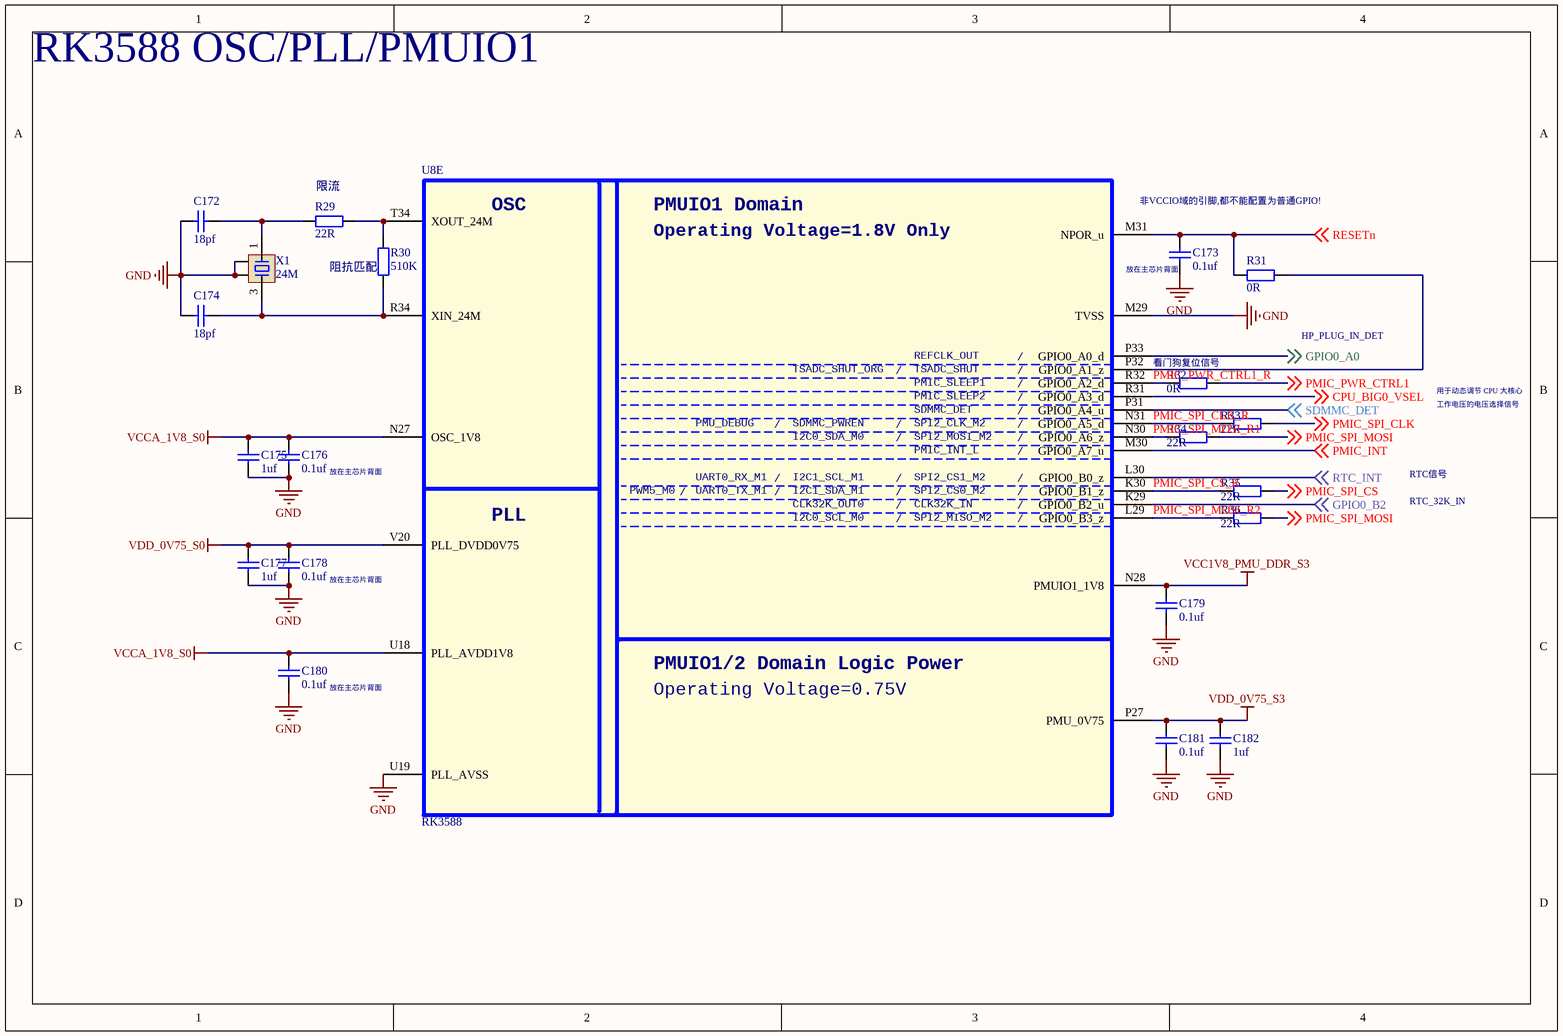
[diagram p4: 5.RK3588_OSC_PLL_PMUIO1.SchDoc]

### Parts
C172  18pf  [C0402_L]
C173  0.1uf  [C0201_L]
C174  18pf  [C0402_L]
C175  1uf  [C0201_L]
C176  0.1uf  [C0201_L]
C177  1uf  [C0201_L]
C178  0.1uf  [C0201_L]
C179  0.1uf  [C0201_L]
C180  0.1uf  [C0201_L]
C181  0.1uf  [C0201_L]
C182  1uf  [C0201_L]
R29  22R  [R0402_L]
R30  510K  [R0402_L]
R31  0R  [R0201_L]
R32  0R  [R0201_L]
R33  22R  [R0201_L]
R34  22R  [R0201_L]
R35  22R  [R0201_L]
R36  22R  [R0201_L]
U8  RK3588  [BGA1088_23R00X23R00X2R00]  (part E of 26)
X1  24M  [XTAL-3225-4P]

### Nets
GND: C172.1 C173.1 C174.1 C175.1 C176.1 C177.1 C178.1 C179.1 C180.1 C181.1 C182.1 U8.M29(TVSS) U8.U19(PLL_AVSS) X1.2 X1.4
VCC1V8_PMU_DDR_S3: C179.2 U8.N28(PMUIO1_1V8)
VCCA_1V8_S0: C175.2 C176.2 C180.2 U8.N27(OSC_1V8) U8.U18(PLL_AVDD1V8)  [project net AVDD1V8_DDR_PLL_S0]
VDD_0V75_S0: C177.2 C178.2 U8.V20(PLL_DVDD0V75)
VDD_0V75_S3: C181.2 C182.2 U8.P27(PMU_0V75)
CPU_BIG0_VSEL: U8.R31(GPIO0_A3_d) ; off-sheet CPU_BIG0_VSEL
GPIO0_A0: U8.P33(GPIO0_A0_d) ; off-sheet GPIO0_A0
GPIO0_B2: U8.K29(GPIO0_B2_u) ; off-sheet GPIO0_B2
PMIC_INT: U8.M30(GPIO0_A7_u) ; off-sheet PMIC_INT
PMIC_PWR_CTRL1: R32.2 ; off-sheet PMIC_PWR_CTRL1
PMIC_PWR_CTRL1_R: R32.1 U8.R32(GPIO0_A2_d)
PMIC_SPI_CLK: R33.2 ; off-sheet PMIC_SPI_CLK
PMIC_SPI_CLK_R: R33.1 U8.N31(GPIO0_A5_d)
PMIC_SPI_CS: R35.2 ; off-sheet PMIC_SPI_CS
PMIC_SPI_CS_R: R35.1 U8.K30(GPIO0_B1_z)
PMIC_SPI_MOSI: R34.2 R36.2 ; off-sheet PMIC_SPI_MOSI
PMIC_SPI_MOSI_R1: R34.1 U8.N30(GPIO0_A6_z)
PMIC_SPI_MOSI_R2: R36.1 U8.L29(GPIO0_B3_z)
RESETn: C173.2 R31.1 U8.M31(NPOR_u) ; off-sheet RESETn
RTC_INT: U8.L30(GPIO0_B0_z) ; off-sheet RTC_INT
SDMMC_DET: U8.P31(GPIO0_A4_u) ; off-sheet SDMMC_DET
NetC172_2: C172.2 R29.2 X1.1
NetC174_2: C174.2 R30.1 U8.R34(XIN_24M) X1.3
NetR29_1: R29.1 R30.2 U8.T34(XOUT_24M)
NetR31_2: R31.2 U8.P32(GPIO0_A1_z)

### Notes on the sheet
- RK3588 OSC/PLL/PMUIO1
- (near R29) 限流
- 非VCCIO域的引脚,都不能配置为普通GPIO!
- 阻抗匹配
- (near U8) 放在主芯片背面
- (near R32) 看门狗复位信号
- HP_PLUG_IN_DET
- 用于动态调节 CPU 大核心
- 工作电压的电压选择信号
- (near C176) 放在主芯片背面
- RTC信号
- RTC_32K_IN
- (near C178) 放在主芯片背面
- (near C180) 放在主芯片背面
- (in symbol SOC_RK3588, part E) OSC; PMUIO1 Domain; Operating Voltage=1.8V Only; REFCLK_OUT; /; TSADC_SHUT_ORG; TSADC_SHUT; PMIC_SLEEP1; PMIC_SLEEP2; SDMMC_DET; PMU_DEBUG; SDMMC_PWREN; SPI2_CLK_M2; I2C0_SDA_M0; SPI2_MOSI_M2; PMIC_INT_L; UART0_RX_M1; I2C1_SCL_M1; SPI2_CS1_M2; PWM5_M0; UART0_TX_M1; I2C1_SDA_M1; SPI2_CS0_M2; CLK32K_OUT0; CLK32K_IN; PLL; I2C0_SCL_M0; SPI2_MISO_M2; PMUIO1/2 Domain Logic Power; Operating Voltage=0.75V

### Library data of the parts
C172-C182 = C: 贴片电容/MLCC电容
R29-R36 = R: 贴片电阻
U8 = SOC_RK3588: ROCKCHIP SOC
X1 = XTAL-4P: 4脚无源晶振(谐振器）

## Sheet 6.RK3588_PMUIO2.SchDoc
size A4; SheetNumber: 6; SheetTotal: 21
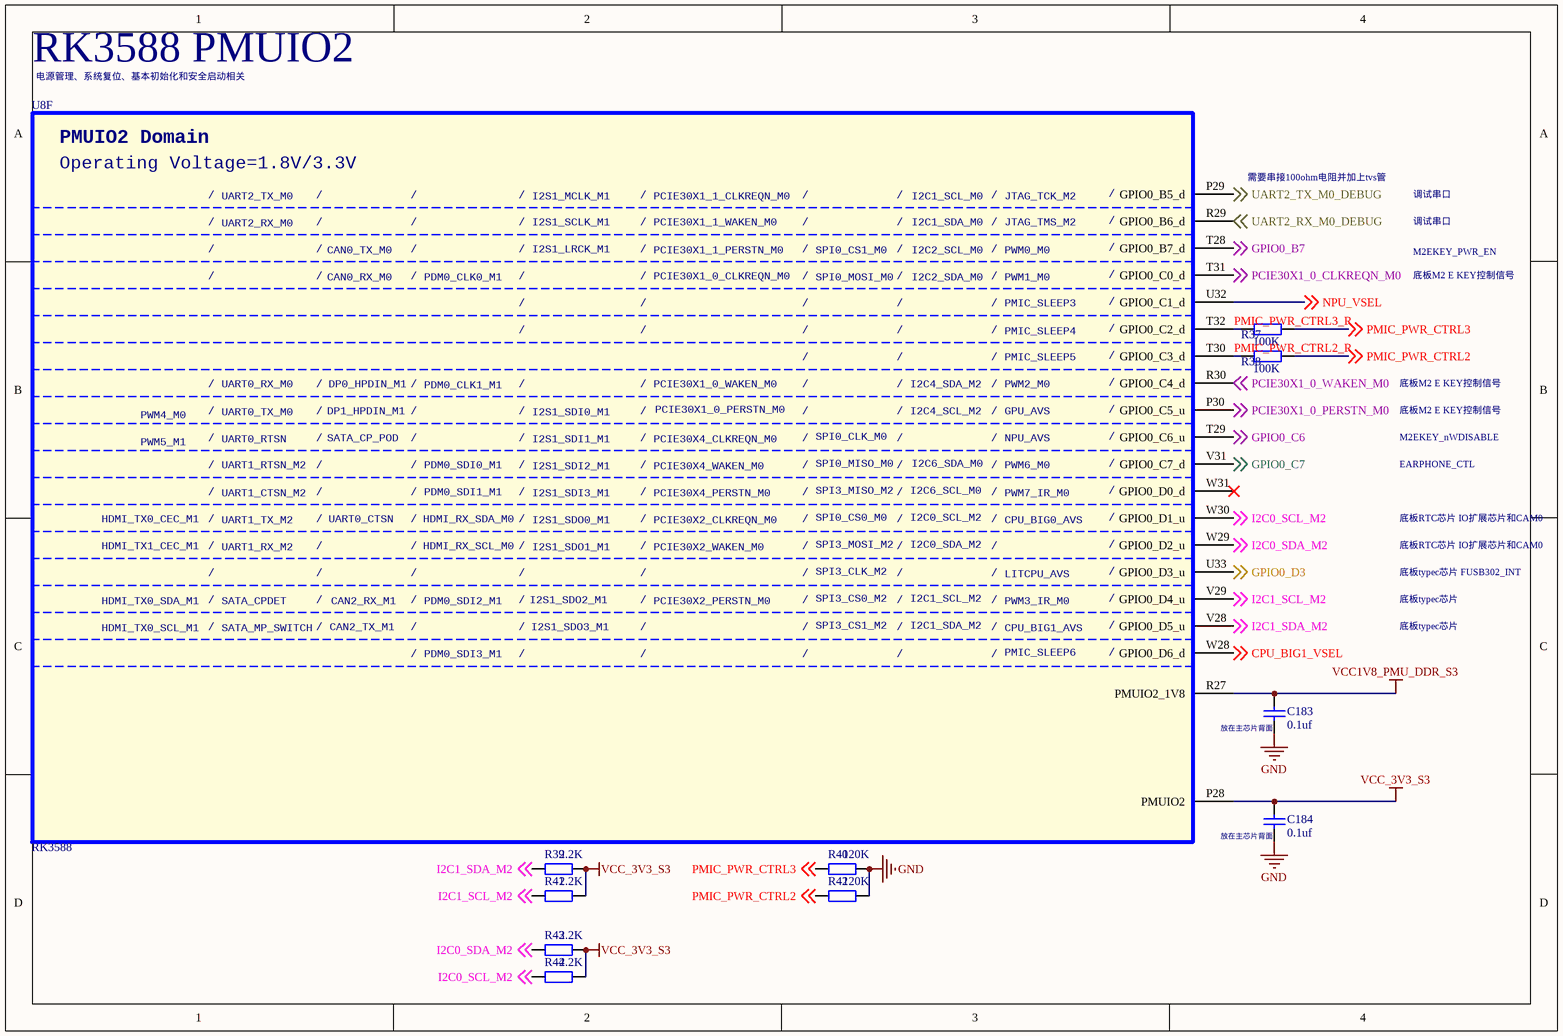
[diagram p5: 6.RK3588_PMUIO2.SchDoc]

### Parts
C183  0.1uf  [C0201_L]
C184  0.1uf  [C0201_L]
R37  100K  [R0201_L]
R38  100K  [R0201_L]
R39  2.2K  [R0201_L]
R40  120K  [R0201_L]
R41  2.2K  [R0201_L]
R42  120K  [R0201_L]
R43  2.2K  [R0201_L]
R44  2.2K  [R0201_L]
U8  RK3588  [BGA1088_23R00X23R00X2R00]  (part F of 26)

### Nets
GND: C183.1 C184.1 R40.1 R42.1
VCC1V8_PMU_DDR_S3: C183.2 U8.R27(PMUIO2_1V8)
VCC_3V3_S3: C184.2 R39.1 R41.1 R43.1 R44.1 U8.P28(PMUIO2)
CPU_BIG1_VSEL: U8.W28(GPIO0_D6_d) ; off-sheet CPU_BIG1_VSEL
GPIO0_B7: U8.T28(GPIO0_B7_d) ; off-sheet GPIO0_B7
GPIO0_C6: U8.T29(GPIO0_C6_u) ; off-sheet GPIO0_C6
GPIO0_C7: U8.V31(GPIO0_C7_d) ; off-sheet GPIO0_C7
GPIO0_D3: U8.U33(GPIO0_D3_u) ; off-sheet GPIO0_D3
I2C0_SCL_M2: R44.2 U8.W30(GPIO0_D1_u) ; off-sheet I2C0_SCL_M2
I2C0_SDA_M2: R43.2 U8.W29(GPIO0_D2_u) ; off-sheet I2C0_SDA_M2
I2C1_SCL_M2: R41.2 U8.V29(GPIO0_D4_u) ; off-sheet I2C1_SCL_M2
I2C1_SDA_M2: R39.2 U8.V28(GPIO0_D5_u) ; off-sheet I2C1_SDA_M2
NPU_VSEL: U8.U32(GPIO0_C1_d) ; off-sheet NPU_VSEL
PCIE30X1_0_CLKREQN_M0: U8.T31(GPIO0_C0_d) ; off-sheet PCIE30X1_0_CLKREQN_M0
PCIE30X1_0_PERSTN_M0: U8.P30(GPIO0_C5_u) ; off-sheet PCIE30X1_0_PERSTN_M0
PCIE30X1_0_WAKEN_M0: U8.R30(GPIO0_C4_d) ; off-sheet PCIE30X1_0_WAKEN_M0
PMIC_PWR_CTRL2: R38.2 R42.2 ; off-sheet PMIC_PWR_CTRL2
PMIC_PWR_CTRL2_R: R38.1 U8.T30(GPIO0_C3_d)
PMIC_PWR_CTRL3: R37.2 R40.2 ; off-sheet PMIC_PWR_CTRL3
PMIC_PWR_CTRL3_R: R37.1 U8.T32(GPIO0_C2_d)
UART2_RX_M0_DEBUG: U8.R29(GPIO0_B6_d) ; off-sheet UART2_RX_M0_DEBUG
UART2_TX_M0_DEBUG: U8.P29(GPIO0_B5_d) ; off-sheet UART2_TX_M0_DEBUG

Not connected (* = marked no-connect by the designer): U8 W31(GPIO0_D0_d)*

### Notes on the sheet
- RK3588 PMUIO2
- 电源管理、系统复位、基本初始化和安全启动相关
- 需要串接100ohm电阻并加上tvs管
- 调试串口
- 底板M2 E KEY控制信号
- M2EKEY_PWR_EN
- M2EKEY_nWDISABLE
- 底板RTC芯片 IO扩展芯片和CAM0
- EARPHONE_CTL
- 底板typec芯片 FUSB302_INT
- 底板typec芯片
- 放在主芯片背面
- (in symbol SOC_RK3588, part F) PMUIO2 Domain; Operating Voltage=1.8V/3.3V; /; UART2_TX_M0; I2S1_MCLK_M1; PCIE30X1_1_CLKREQN_M0; I2C1_SCL_M0; JTAG_TCK_M2; UART2_RX_M0; I2S1_SCLK_M1; PCIE30X1_1_WAKEN_M0; I2C1_SDA_M0; JTAG_TMS_M2; CAN0_TX_M0; I2S1_LRCK_M1; PCIE30X1_1_PERSTN_M0; SPI0_CS1_M0; I2C2_SCL_M0; PWM0_M0; CAN0_RX_M0; PDM0_CLK0_M1; PCIE30X1_0_CLKREQN_M0; SPI0_MOSI_M0; I2C2_SDA_M0; PWM1_M0; PMIC_SLEEP3; PMIC_SLEEP4; PMIC_SLEEP5; UART0_RX_M0; DP0_HPDIN_M1; PDM0_CLK1_M1; PCIE30X1_0_WAKEN_M0; I2C4_SDA_M2; PWM2_M0; UART0_TX_M0; DP1_HPDIN_M1; I2S1_SDI0_M1; PCIE30X1_0_PERSTN_M0; I2C4_SCL_M2; GPU_AVS; PWM4_M0; UART0_RTSN; SATA_CP_POD; I2S1_SDI1_M1; PCIE30X4_CLKREQN_M0; SPI0_CLK_M0; NPU_AVS; PWM5_M1; UART1_RTSN_M2; PDM0_SDI0_M1; I2S1_SDI2_M1; PCIE30X4_WAKEN_M0; SPI0_MISO_M0; I2C6_SDA_M0; PWM6_M0; UART1_CTSN_M2; PDM0_SDI1_M1; I2S1_SDI3_M1; PCIE30X4_PERSTN_M0; SPI3_MISO_M2; I2C6_SCL_M0; PWM7_IR_M0; HDMI_TX0_CEC_M1; UART1_TX_M2; UART0_CTSN; HDMI_RX_SDA_M0; I2S1_SDO0_M1; PCIE30X2_CLKREQN_M0; SPI0_CS0_M0; I2C0_SCL_M2; CPU_BIG0_AVS; HDMI_TX1_CEC_M1; UART1_RX_M2; HDMI_RX_SCL_M0; I2S1_SDO1_M1; PCIE30X2_WAKEN_M0; SPI3_MOSI_M2; I2C0_SDA_M2; SPI3_CLK_M2; LITCPU_AVS; HDMI_TX0_SDA_M1; SATA_CPDET; CAN2_RX_M1; PDM0_SDI2_M1; I2S1_SDO2_M1; PCIE30X2_PERSTN_M0; SPI3_CS0_M2; I2C1_SCL_M2; PWM3_IR_M0; HDMI_TX0_SCL_M1; SATA_MP_SWITCH; CAN2_TX_M1; I2S1_SDO3_M1; SPI3_CS1_M2; I2C1_SDA_M2; CPU_BIG1_AVS; PDM0_SDI3_M1; PMIC_SLEEP6

### Library data of the parts
C183 C184 = C: 贴片电容/MLCC电容
R37-R44 = R: 贴片电阻
U8 = SOC_RK3588: ROCKCHIP SOC

## Sheet 7.RK3588_DDR_Controler.SchDoc
size A3; SheetNumber: 7; SheetTotal: 21
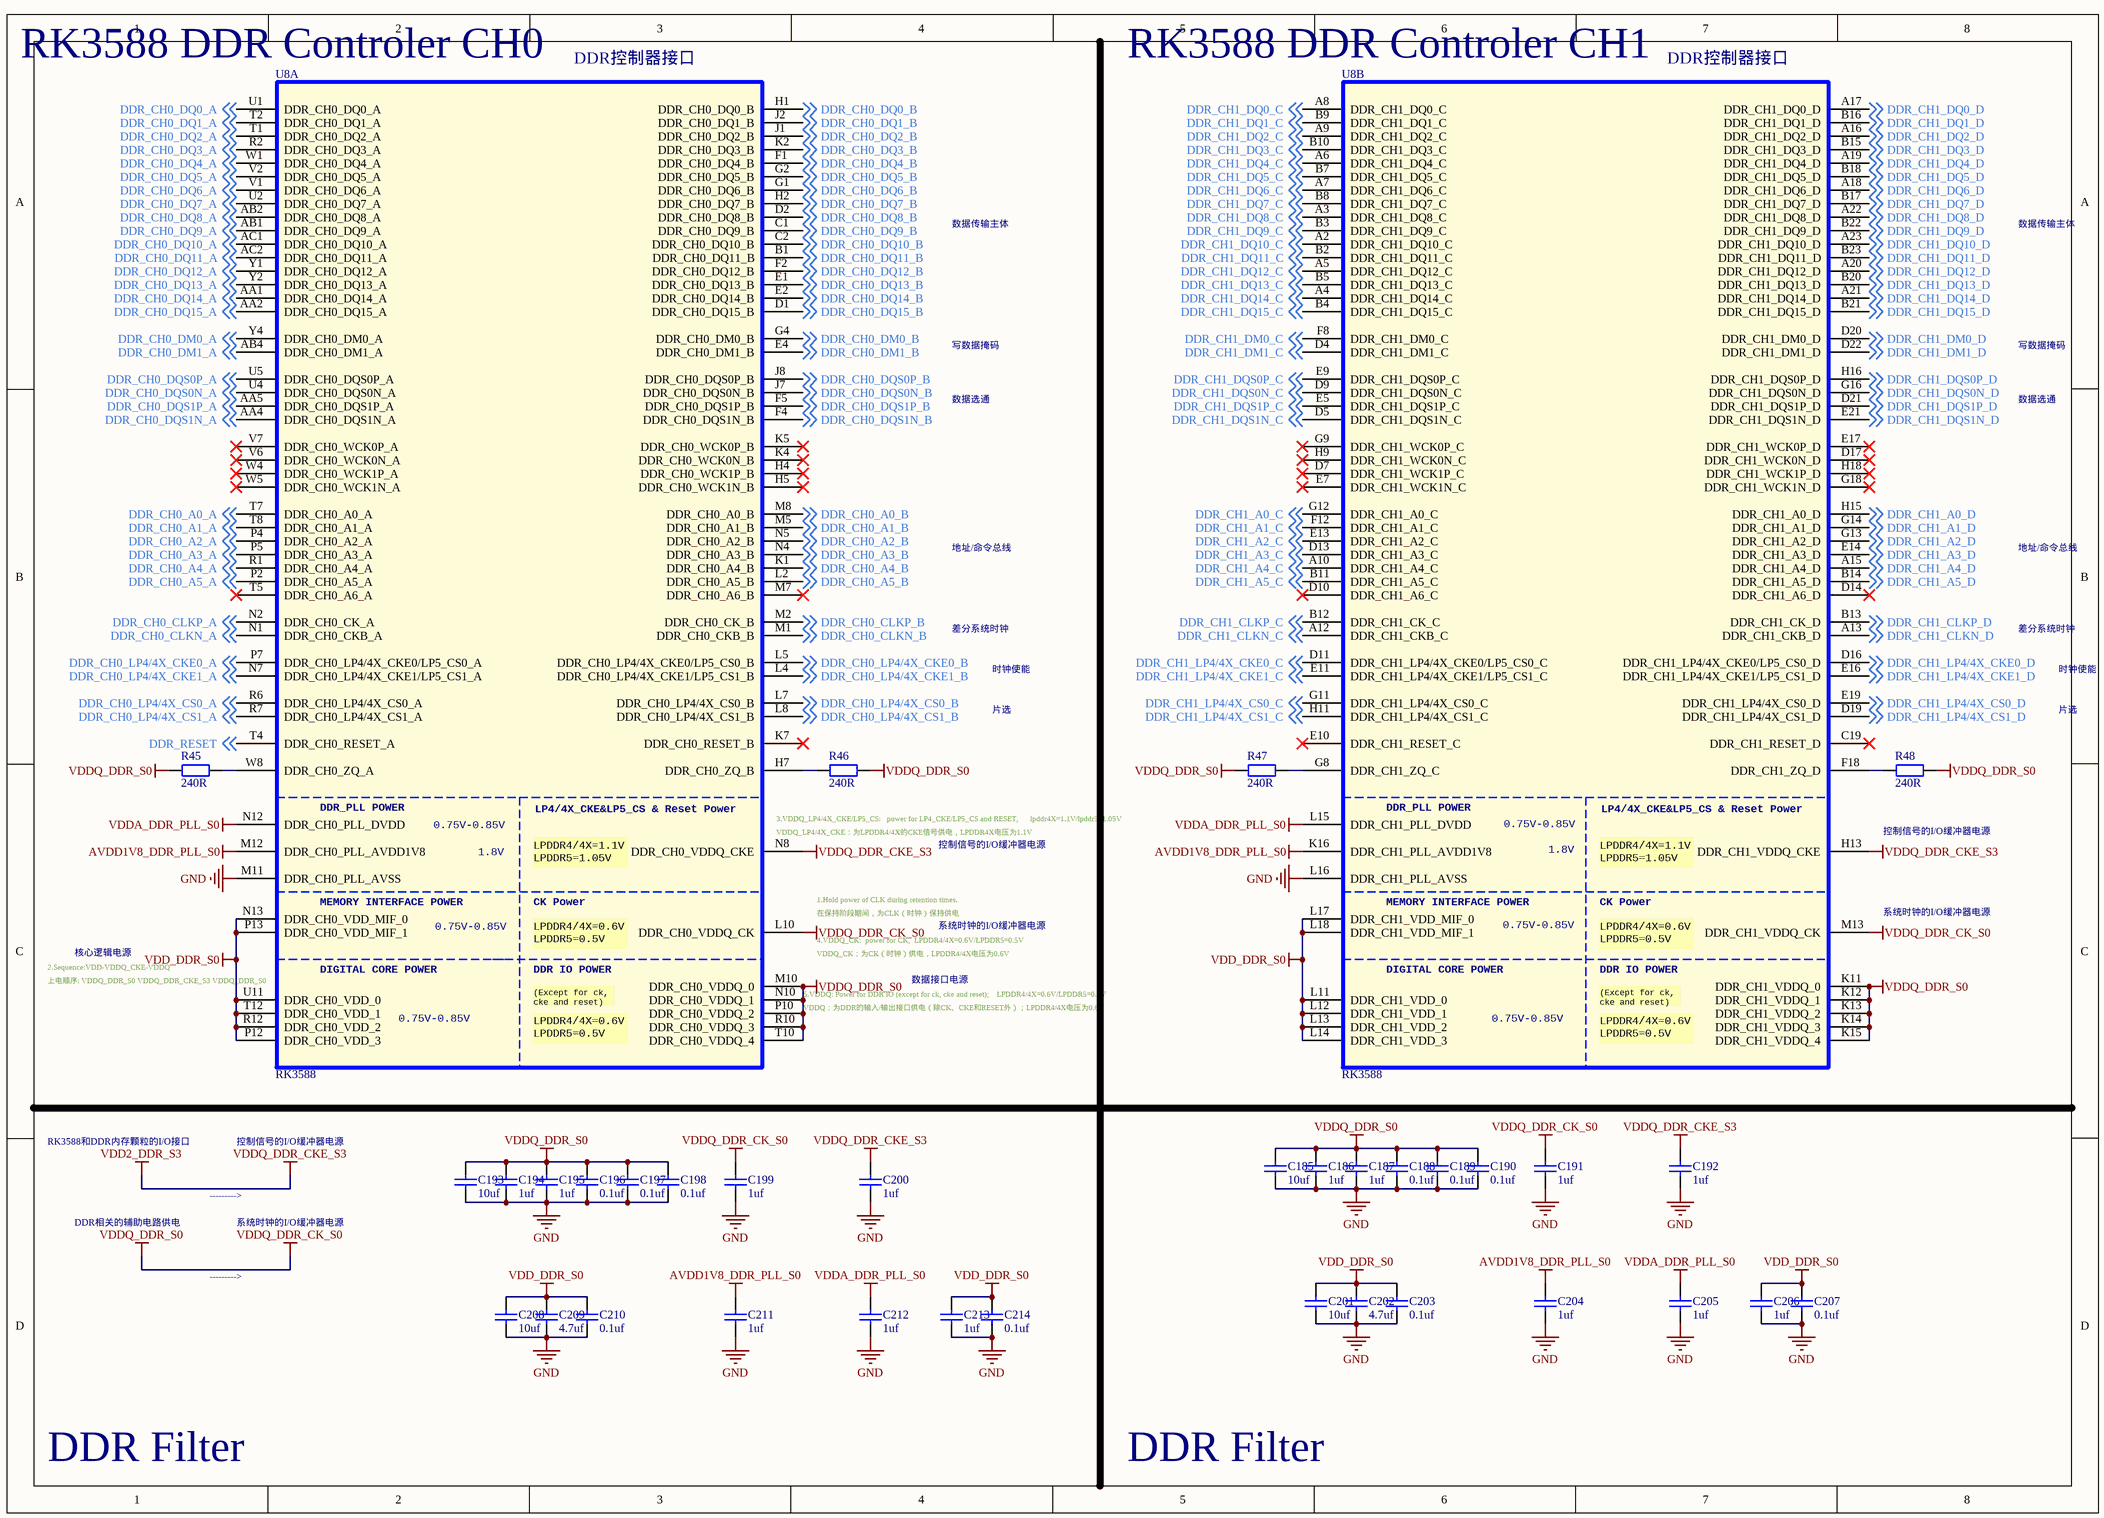
[diagram p6: 7.RK3588_DDR_Controler.SchDoc]

### Parts
C185  10uf  [C0402_L]
C186  1uf  [C0201_L]
C187  1uf  [C0201_L]
C188  0.1uf  [C0201_L]
C189  0.1uf  [C0201_L]
C190  0.1uf  [C0201_L]
C191  1uf  [C0201_L]
C192  1uf  [C0201_L]
C193  10uf  [C0402_L]
C194  1uf  [C0201_L]
C195  1uf  [C0201_L]
C196  0.1uf  [C0201_L]
C197  0.1uf  [C0201_L]
C198  0.1uf  [C0201_L]
C199  1uf  [C0201_L]
C200  1uf  [C0201_L]
C201  10uf  [C0402_L]
C202  4.7uf  [C0201_L]
C203  0.1uf  [C0201_L]
C204  1uf  [C0201_L]
C205  1uf  [C0201_L]
C206  1uf  [C0201_L]
C207  0.1uf  [C0201_L]
C208  10uf  [C0201_L]
C209  4.7uf  [C0201_L]
C210  0.1uf  [C0201_L]
C211  1uf  [C0201_L]
C212  1uf  [C0201_L]
C213  1uf  [C0201_L]
C214  0.1uf  [C0201_L]
R45  240R  [R0201_L]
R46  240R  [R0201_L]
R47  240R  [R0201_L]
R48  240R  [R0201_L]
U8  RK3588  [BGA1088_23R00X23R00X2R00]  (parts A,B of 26)

### Nets
AVDD1V8_DDR_PLL_S0: C204.2 C211.2 U8.K16(DDR_CH1_PLL_AVDD1V8) U8.M12(DDR_CH0_PLL_AVDD1V8)
GND: C185.1 C186.1 C187.1 C188.1 C189.1 C190.1 C191.1 C192.1 C193.1 C194.1 C195.1 C196.1 C197.1 C198.1 C199.1 C200.1 C201.1 C202.1 C203.1 C204.1 C205.1 C206.1 C207.1 C208.1 C209.1 C210.1 C211.1 C212.1 C213.1 C214.1 U8.L16(DDR_CH1_PLL_AVSS) U8.M11(DDR_CH0_PLL_AVSS)
VDD2_DDR_S3: C192.2 C200.2 U8.H13(DDR_CH1_VDDQ_CKE) U8.N8(DDR_CH0_VDDQ_CKE)  [also labelled VDDQ_DDR_CKE_S3]
VDD_DDR_S0: C201.2 C202.2 C203.2 C206.2 C207.2 C208.2 C209.2 C210.2 C213.2 C214.2 U8.L11(DDR_CH1_VDD_0) U8.L12(DDR_CH1_VDD_1) U8.L13(DDR_CH1_VDD_2) U8.L14(DDR_CH1_VDD_3) U8.L17(DDR_CH1_VDD_MIF_0) U8.L18(DDR_CH1_VDD_MIF_1) U8.N13(DDR_CH0_VDD_MIF_0) U8.P12(DDR_CH0_VDD_3) U8.P13(DDR_CH0_VDD_MIF_1) U8.R12(DDR_CH0_VDD_2) U8.T12(DDR_CH0_VDD_1) U8.U11(DDR_CH0_VDD_0)
VDDA_DDR_PLL_S0: C205.2 C212.2 U8.L15(DDR_CH1_PLL_DVDD) U8.N12(DDR_CH0_PLL_DVDD)
VDDQ_DDR_CK_S0: C185.2 C186.2 C187.2 C188.2 C189.2 C190.2 C191.2 C193.2 C194.2 C195.2 C196.2 C197.2 C198.2 C199.2 R45.1 R46.1 R47.1 R48.1 U8.K11(DDR_CH1_VDDQ_0) U8.K12(DDR_CH1_VDDQ_1) U8.K13(DDR_CH1_VDDQ_2) U8.K14(DDR_CH1_VDDQ_3) U8.K15(DDR_CH1_VDDQ_4) U8.L10(DDR_CH0_VDDQ_CK) U8.M10(DDR_CH0_VDDQ_0) U8.M13(DDR_CH1_VDDQ_CK) U8.N10(DDR_CH0_VDDQ_1) U8.P10(DDR_CH0_VDDQ_2) U8.R10(DDR_CH0_VDDQ_3) U8.T10(DDR_CH0_VDDQ_4)  [also labelled VDDQ_DDR_S0]  [project net VDDQ_DDR]
DDR_CH0_A0_A: U8.T7(DDR_CH0_A0_A) ; off-sheet DDR_CH0_A0_A
DDR_CH0_A0_B: U8.M8(DDR_CH0_A0_B) ; off-sheet DDR_CH0_A0_B
DDR_CH0_A1_A: U8.T8(DDR_CH0_A1_A) ; off-sheet DDR_CH0_A1_A
DDR_CH0_A1_B: U8.M5(DDR_CH0_A1_B) ; off-sheet DDR_CH0_A1_B
DDR_CH0_A2_A: U8.P4(DDR_CH0_A2_A) ; off-sheet DDR_CH0_A2_A
DDR_CH0_A2_B: U8.N5(DDR_CH0_A2_B) ; off-sheet DDR_CH0_A2_B
DDR_CH0_A3_A: U8.P5(DDR_CH0_A3_A) ; off-sheet DDR_CH0_A3_A
DDR_CH0_A3_B: U8.N4(DDR_CH0_A3_B) ; off-sheet DDR_CH0_A3_B
DDR_CH0_A4_A: U8.R1(DDR_CH0_A4_A) ; off-sheet DDR_CH0_A4_A
DDR_CH0_A4_B: U8.K1(DDR_CH0_A4_B) ; off-sheet DDR_CH0_A4_B
DDR_CH0_A5_A: U8.P2(DDR_CH0_A5_A) ; off-sheet DDR_CH0_A5_A
DDR_CH0_A5_B: U8.L2(DDR_CH0_A5_B) ; off-sheet DDR_CH0_A5_B
DDR_CH0_CLKN_A: U8.N1(DDR_CH0_CKB_A) ; off-sheet DDR_CH0_CLKN_A
DDR_CH0_CLKN_B: U8.M1(DDR_CH0_CKB_B) ; off-sheet DDR_CH0_CLKN_B
DDR_CH0_CLKP_A: U8.N2(DDR_CH0_CK_A) ; off-sheet DDR_CH0_CLKP_A
DDR_CH0_CLKP_B: U8.M2(DDR_CH0_CK_B) ; off-sheet DDR_CH0_CLKP_B
DDR_CH0_DM0_A: U8.Y4(DDR_CH0_DM0_A) ; off-sheet DDR_CH0_DM0_A
DDR_CH0_DM0_B: U8.G4(DDR_CH0_DM0_B) ; off-sheet DDR_CH0_DM0_B
DDR_CH0_DM1_A: U8.AB4(DDR_CH0_DM1_A) ; off-sheet DDR_CH0_DM1_A
DDR_CH0_DM1_B: U8.E4(DDR_CH0_DM1_B) ; off-sheet DDR_CH0_DM1_B
DDR_CH0_DQ0_A: U8.U1(DDR_CH0_DQ0_A) ; off-sheet DDR_CH0_DQ0_A
DDR_CH0_DQ0_B: U8.H1(DDR_CH0_DQ0_B) ; off-sheet DDR_CH0_DQ0_B
DDR_CH0_DQ1_A: U8.T2(DDR_CH0_DQ1_A) ; off-sheet DDR_CH0_DQ1_A
DDR_CH0_DQ1_B: U8.J2(DDR_CH0_DQ1_B) ; off-sheet DDR_CH0_DQ1_B
DDR_CH0_DQ2_A: U8.T1(DDR_CH0_DQ2_A) ; off-sheet DDR_CH0_DQ2_A
DDR_CH0_DQ2_B: U8.J1(DDR_CH0_DQ2_B) ; off-sheet DDR_CH0_DQ2_B
DDR_CH0_DQ3_A: U8.R2(DDR_CH0_DQ3_A) ; off-sheet DDR_CH0_DQ3_A
DDR_CH0_DQ3_B: U8.K2(DDR_CH0_DQ3_B) ; off-sheet DDR_CH0_DQ3_B
DDR_CH0_DQ4_A: U8.W1(DDR_CH0_DQ4_A) ; off-sheet DDR_CH0_DQ4_A
DDR_CH0_DQ4_B: U8.F1(DDR_CH0_DQ4_B) ; off-sheet DDR_CH0_DQ4_B
DDR_CH0_DQ5_A: U8.V2(DDR_CH0_DQ5_A) ; off-sheet DDR_CH0_DQ5_A
DDR_CH0_DQ5_B: U8.G2(DDR_CH0_DQ5_B) ; off-sheet DDR_CH0_DQ5_B
DDR_CH0_DQ6_A: U8.V1(DDR_CH0_DQ6_A) ; off-sheet DDR_CH0_DQ6_A
DDR_CH0_DQ6_B: U8.G1(DDR_CH0_DQ6_B) ; off-sheet DDR_CH0_DQ6_B
DDR_CH0_DQ7_A: U8.U2(DDR_CH0_DQ7_A) ; off-sheet DDR_CH0_DQ7_A
DDR_CH0_DQ7_B: U8.H2(DDR_CH0_DQ7_B) ; off-sheet DDR_CH0_DQ7_B
DDR_CH0_DQ8_A: U8.AB2(DDR_CH0_DQ8_A) ; off-sheet DDR_CH0_DQ8_A
DDR_CH0_DQ8_B: U8.D2(DDR_CH0_DQ8_B) ; off-sheet DDR_CH0_DQ8_B
DDR_CH0_DQ9_A: U8.AB1(DDR_CH0_DQ9_A) ; off-sheet DDR_CH0_DQ9_A
DDR_CH0_DQ9_B: U8.C1(DDR_CH0_DQ9_B) ; off-sheet DDR_CH0_DQ9_B
DDR_CH0_DQ10_A: U8.AC1(DDR_CH0_DQ10_A) ; off-sheet DDR_CH0_DQ10_A
DDR_CH0_DQ10_B: U8.C2(DDR_CH0_DQ10_B) ; off-sheet DDR_CH0_DQ10_B
DDR_CH0_DQ11_A: U8.AC2(DDR_CH0_DQ11_A) ; off-sheet DDR_CH0_DQ11_A
DDR_CH0_DQ11_B: U8.B1(DDR_CH0_DQ11_B) ; off-sheet DDR_CH0_DQ11_B
DDR_CH0_DQ12_A: U8.Y1(DDR_CH0_DQ12_A) ; off-sheet DDR_CH0_DQ12_A
DDR_CH0_DQ12_B: U8.F2(DDR_CH0_DQ12_B) ; off-sheet DDR_CH0_DQ12_B
DDR_CH0_DQ13_A: U8.Y2(DDR_CH0_DQ13_A) ; off-sheet DDR_CH0_DQ13_A
DDR_CH0_DQ13_B: U8.E1(DDR_CH0_DQ13_B) ; off-sheet DDR_CH0_DQ13_B
DDR_CH0_DQ14_A: U8.AA1(DDR_CH0_DQ14_A) ; off-sheet DDR_CH0_DQ14_A
DDR_CH0_DQ14_B: U8.E2(DDR_CH0_DQ14_B) ; off-sheet DDR_CH0_DQ14_B
DDR_CH0_DQ15_A: U8.AA2(DDR_CH0_DQ15_A) ; off-sheet DDR_CH0_DQ15_A
DDR_CH0_DQ15_B: U8.D1(DDR_CH0_DQ15_B) ; off-sheet DDR_CH0_DQ15_B
DDR_CH0_DQS0N_A: U8.U4(DDR_CH0_DQS0N_A) ; off-sheet DDR_CH0_DQS0N_A
DDR_CH0_DQS0N_B: U8.J7(DDR_CH0_DQS0N_B) ; off-sheet DDR_CH0_DQS0N_B
DDR_CH0_DQS0P_A: U8.U5(DDR_CH0_DQS0P_A) ; off-sheet DDR_CH0_DQS0P_A
DDR_CH0_DQS0P_B: U8.J8(DDR_CH0_DQS0P_B) ; off-sheet DDR_CH0_DQS0P_B
DDR_CH0_DQS1N_A: U8.AA4(DDR_CH0_DQS1N_A) ; off-sheet DDR_CH0_DQS1N_A
DDR_CH0_DQS1N_B: U8.F4(DDR_CH0_DQS1N_B) ; off-sheet DDR_CH0_DQS1N_B
DDR_CH0_DQS1P_A: U8.AA5(DDR_CH0_DQS1P_A) ; off-sheet DDR_CH0_DQS1P_A
DDR_CH0_DQS1P_B: U8.F5(DDR_CH0_DQS1P_B) ; off-sheet DDR_CH0_DQS1P_B
DDR_CH0_LP4/4X_CKE0_A: U8.P7(DDR_CH0_LP4/4X_CKE0/LP5_CS0_A) ; off-sheet DDR_CH0_LP4/4X_CKE0_A
DDR_CH0_LP4/4X_CKE0_B: U8.L5(DDR_CH0_LP4/4X_CKE0/LP5_CS0_B) ; off-sheet DDR_CH0_LP4/4X_CKE0_B
DDR_CH0_LP4/4X_CKE1_A: U8.N7(DDR_CH0_LP4/4X_CKE1/LP5_CS1_A) ; off-sheet DDR_CH0_LP4/4X_CKE1_A
DDR_CH0_LP4/4X_CKE1_B: U8.L4(DDR_CH0_LP4/4X_CKE1/LP5_CS1_B) ; off-sheet DDR_CH0_LP4/4X_CKE1_B
DDR_CH0_LP4/4X_CS0_A: U8.R6(DDR_CH0_LP4/4X_CS0_A) ; off-sheet DDR_CH0_LP4/4X_CS0_A
DDR_CH0_LP4/4X_CS0_B: U8.L7(DDR_CH0_LP4/4X_CS0_B) ; off-sheet DDR_CH0_LP4/4X_CS0_B
DDR_CH0_LP4/4X_CS1_A: U8.R7(DDR_CH0_LP4/4X_CS1_A) ; off-sheet DDR_CH0_LP4/4X_CS1_A
DDR_CH0_LP4/4X_CS1_B: U8.L8(DDR_CH0_LP4/4X_CS1_B) ; off-sheet DDR_CH0_LP4/4X_CS1_B
DDR_CH1_A0_C: U8.G12(DDR_CH1_A0_C) ; off-sheet DDR_CH1_A0_C
DDR_CH1_A0_D: U8.H15(DDR_CH1_A0_D) ; off-sheet DDR_CH1_A0_D
DDR_CH1_A1_C: U8.F12(DDR_CH1_A1_C) ; off-sheet DDR_CH1_A1_C
DDR_CH1_A1_D: U8.G14(DDR_CH1_A1_D) ; off-sheet DDR_CH1_A1_D
DDR_CH1_A2_C: U8.E13(DDR_CH1_A2_C) ; off-sheet DDR_CH1_A2_C
DDR_CH1_A2_D: U8.G13(DDR_CH1_A2_D) ; off-sheet DDR_CH1_A2_D
DDR_CH1_A3_C: U8.D13(DDR_CH1_A3_C) ; off-sheet DDR_CH1_A3_C
DDR_CH1_A3_D: U8.E14(DDR_CH1_A3_D) ; off-sheet DDR_CH1_A3_D
DDR_CH1_A4_C: U8.A10(DDR_CH1_A4_C) ; off-sheet DDR_CH1_A4_C
DDR_CH1_A4_D: U8.A15(DDR_CH1_A4_D) ; off-sheet DDR_CH1_A4_D
DDR_CH1_A5_C: U8.B11(DDR_CH1_A5_C) ; off-sheet DDR_CH1_A5_C
DDR_CH1_A5_D: U8.B14(DDR_CH1_A5_D) ; off-sheet DDR_CH1_A5_D
DDR_CH1_CLKN_C: U8.A12(DDR_CH1_CKB_C) ; off-sheet DDR_CH1_CLKN_C
DDR_CH1_CLKN_D: U8.A13(DDR_CH1_CKB_D) ; off-sheet DDR_CH1_CLKN_D
DDR_CH1_CLKP_C: U8.B12(DDR_CH1_CK_C) ; off-sheet DDR_CH1_CLKP_C
DDR_CH1_CLKP_D: U8.B13(DDR_CH1_CK_D) ; off-sheet DDR_CH1_CLKP_D
DDR_CH1_DM0_C: U8.F8(DDR_CH1_DM0_C) ; off-sheet DDR_CH1_DM0_C
DDR_CH1_DM0_D: U8.D20(DDR_CH1_DM0_D) ; off-sheet DDR_CH1_DM0_D
DDR_CH1_DM1_C: U8.D4(DDR_CH1_DM1_C) ; off-sheet DDR_CH1_DM1_C
DDR_CH1_DM1_D: U8.D22(DDR_CH1_DM1_D) ; off-sheet DDR_CH1_DM1_D
DDR_CH1_DQ0_C: U8.A8(DDR_CH1_DQ0_C) ; off-sheet DDR_CH1_DQ0_C
DDR_CH1_DQ0_D: U8.A17(DDR_CH1_DQ0_D) ; off-sheet DDR_CH1_DQ0_D
DDR_CH1_DQ1_C: U8.B9(DDR_CH1_DQ1_C) ; off-sheet DDR_CH1_DQ1_C
DDR_CH1_DQ1_D: U8.B16(DDR_CH1_DQ1_D) ; off-sheet DDR_CH1_DQ1_D
DDR_CH1_DQ2_C: U8.A9(DDR_CH1_DQ2_C) ; off-sheet DDR_CH1_DQ2_C
DDR_CH1_DQ2_D: U8.A16(DDR_CH1_DQ2_D) ; off-sheet DDR_CH1_DQ2_D
DDR_CH1_DQ3_C: U8.B10(DDR_CH1_DQ3_C) ; off-sheet DDR_CH1_DQ3_C
DDR_CH1_DQ3_D: U8.B15(DDR_CH1_DQ3_D) ; off-sheet DDR_CH1_DQ3_D
DDR_CH1_DQ4_C: U8.A6(DDR_CH1_DQ4_C) ; off-sheet DDR_CH1_DQ4_C
DDR_CH1_DQ4_D: U8.A19(DDR_CH1_DQ4_D) ; off-sheet DDR_CH1_DQ4_D
DDR_CH1_DQ5_C: U8.B7(DDR_CH1_DQ5_C) ; off-sheet DDR_CH1_DQ5_C
DDR_CH1_DQ5_D: U8.B18(DDR_CH1_DQ5_D) ; off-sheet DDR_CH1_DQ5_D
DDR_CH1_DQ6_C: U8.A7(DDR_CH1_DQ6_C) ; off-sheet DDR_CH1_DQ6_C
DDR_CH1_DQ6_D: U8.A18(DDR_CH1_DQ6_D) ; off-sheet DDR_CH1_DQ6_D
DDR_CH1_DQ7_C: U8.B8(DDR_CH1_DQ7_C) ; off-sheet DDR_CH1_DQ7_C
DDR_CH1_DQ7_D: U8.B17(DDR_CH1_DQ7_D) ; off-sheet DDR_CH1_DQ7_D
DDR_CH1_DQ8_C: U8.A3(DDR_CH1_DQ8_C) ; off-sheet DDR_CH1_DQ8_C
DDR_CH1_DQ8_D: U8.A22(DDR_CH1_DQ8_D) ; off-sheet DDR_CH1_DQ8_D
DDR_CH1_DQ9_C: U8.B3(DDR_CH1_DQ9_C) ; off-sheet DDR_CH1_DQ9_C
DDR_CH1_DQ9_D: U8.B22(DDR_CH1_DQ9_D) ; off-sheet DDR_CH1_DQ9_D
DDR_CH1_DQ10_C: U8.A2(DDR_CH1_DQ10_C) ; off-sheet DDR_CH1_DQ10_C
DDR_CH1_DQ10_D: U8.A23(DDR_CH1_DQ10_D) ; off-sheet DDR_CH1_DQ10_D
DDR_CH1_DQ11_C: U8.B2(DDR_CH1_DQ11_C) ; off-sheet DDR_CH1_DQ11_C
DDR_CH1_DQ11_D: U8.B23(DDR_CH1_DQ11_D) ; off-sheet DDR_CH1_DQ11_D
DDR_CH1_DQ12_C: U8.A5(DDR_CH1_DQ12_C) ; off-sheet DDR_CH1_DQ12_C
DDR_CH1_DQ12_D: U8.A20(DDR_CH1_DQ12_D) ; off-sheet DDR_CH1_DQ12_D
DDR_CH1_DQ13_C: U8.B5(DDR_CH1_DQ13_C) ; off-sheet DDR_CH1_DQ13_C
DDR_CH1_DQ13_D: U8.B20(DDR_CH1_DQ13_D) ; off-sheet DDR_CH1_DQ13_D
DDR_CH1_DQ14_C: U8.A4(DDR_CH1_DQ14_C) ; off-sheet DDR_CH1_DQ14_C
DDR_CH1_DQ14_D: U8.A21(DDR_CH1_DQ14_D) ; off-sheet DDR_CH1_DQ14_D
DDR_CH1_DQ15_C: U8.B4(DDR_CH1_DQ15_C) ; off-sheet DDR_CH1_DQ15_C
DDR_CH1_DQ15_D: U8.B21(DDR_CH1_DQ15_D) ; off-sheet DDR_CH1_DQ15_D
DDR_CH1_DQS0N_C: U8.D9(DDR_CH1_DQS0N_C) ; off-sheet DDR_CH1_DQS0N_C
DDR_CH1_DQS0N_D: U8.G16(DDR_CH1_DQS0N_D) ; off-sheet DDR_CH1_DQS0N_D
DDR_CH1_DQS0P_C: U8.E9(DDR_CH1_DQS0P_C) ; off-sheet DDR_CH1_DQS0P_C
DDR_CH1_DQS0P_D: U8.H16(DDR_CH1_DQS0P_D) ; off-sheet DDR_CH1_DQS0P_D
DDR_CH1_DQS1N_C: U8.D5(DDR_CH1_DQS1N_C) ; off-sheet DDR_CH1_DQS1N_C
DDR_CH1_DQS1N_D: U8.E21(DDR_CH1_DQS1N_D) ; off-sheet DDR_CH1_DQS1N_D
DDR_CH1_DQS1P_C: U8.E5(DDR_CH1_DQS1P_C) ; off-sheet DDR_CH1_DQS1P_C
DDR_CH1_DQS1P_D: U8.D21(DDR_CH1_DQS1P_D) ; off-sheet DDR_CH1_DQS1P_D
DDR_CH1_LP4/4X_CKE0_C: U8.D11(DDR_CH1_LP4/4X_CKE0/LP5_CS0_C) ; off-sheet DDR_CH1_LP4/4X_CKE0_C
DDR_CH1_LP4/4X_CKE0_D: U8.D16(DDR_CH1_LP4/4X_CKE0/LP5_CS0_D) ; off-sheet DDR_CH1_LP4/4X_CKE0_D
DDR_CH1_LP4/4X_CKE1_C: U8.E11(DDR_CH1_LP4/4X_CKE1/LP5_CS1_C) ; off-sheet DDR_CH1_LP4/4X_CKE1_C
DDR_CH1_LP4/4X_CKE1_D: U8.E16(DDR_CH1_LP4/4X_CKE1/LP5_CS1_D) ; off-sheet DDR_CH1_LP4/4X_CKE1_D
DDR_CH1_LP4/4X_CS0_C: U8.G11(DDR_CH1_LP4/4X_CS0_C) ; off-sheet DDR_CH1_LP4/4X_CS0_C
DDR_CH1_LP4/4X_CS0_D: U8.E19(DDR_CH1_LP4/4X_CS0_D) ; off-sheet DDR_CH1_LP4/4X_CS0_D
DDR_CH1_LP4/4X_CS1_C: U8.H11(DDR_CH1_LP4/4X_CS1_C) ; off-sheet DDR_CH1_LP4/4X_CS1_C
DDR_CH1_LP4/4X_CS1_D: U8.D19(DDR_CH1_LP4/4X_CS1_D) ; off-sheet DDR_CH1_LP4/4X_CS1_D
DDR_RESET: U8.T4(DDR_CH0_RESET_A) ; off-sheet DDR_RESET
NetR45_2: R45.2 U8.W8(DDR_CH0_ZQ_A)
NetR46_2: R46.2 U8.H7(DDR_CH0_ZQ_B)
NetR47_2: R47.2 U8.G8(DDR_CH1_ZQ_C)
NetR48_2: R48.2 U8.F18(DDR_CH1_ZQ_D)

Not connected (* = marked no-connect by the designer): U8 C19(DDR_CH1_RESET_D)* D7(DDR_CH1_WCK1P_C)* D10(DDR_CH1_A6_C)* D14(DDR_CH1_A6_D)* D17(DDR_CH1_WCK0N_D)* E7(DDR_CH1_WCK1N_C)* E10(DDR_CH1_RESET_C)* E17(DDR_CH1_WCK0P_D)* G9(DDR_CH1_WCK0P_C)* G18(DDR_CH1_WCK1N_D)* H4(DDR_CH0_WCK1P_B)* H5(DDR_CH0_WCK1N_B)* H9(DDR_CH1_WCK0N_C)* H18(DDR_CH1_WCK1P_D)* K4(DDR_CH0_WCK0N_B)* K5(DDR_CH0_WCK0P_B)* K7(DDR_CH0_RESET_B)* M7(DDR_CH0_A6_B)* T5(DDR_CH0_A6_A)* V6(DDR_CH0_WCK0N_A)* V7(DDR_CH0_WCK0P_A)* W4(DDR_CH0_WCK1P_A)* W5(DDR_CH0_WCK1N_A)*

### Notes on the sheet
- (near U8) RK3588 DDR Controler CH0
- (near U8) DDR控制器接口
- (near U8) RK3588 DDR Controler CH1
- 数据传输主体
- 写数据掩码
- 数据选通
- 地址/命令总线
- 差分系统时钟
- 时钟使能
- 片选
- (near U8) 3.VDDQ_LP4/4X_CKE/LP5_CS:   power for LP4_CKE/LP5_CS and RESET,      lpddr4X=1.1V/lpddr5=1.05V
- (near U8) VDDQ_LP4/4X_CKE：为LPDDR4/4X的CKE信号供电，LPDDR4X电压为1.1V
- 控制信号的I/O缓冲器电源
- 1.Hold power of CLK during retention times.
- 在保持阶段期间，为CLK（时钟）保持供电
- 系统时钟的I/O缓冲器电源
- 上电顺序: VDDQ_DDR_S0 VDDQ_DDR_CKE_S3 VDDQ_DDR_S0
- 2.Sequence:VDD-VDDQ_CKE-VDDQ
- 核心逻辑电源
- (near U8) 5.VDDQ: Power for DDR IO (except for ck, cke and reset);    LPDDR4/4X=0.6V/LPDDR5=0.5V
- 4.VDDQ_CK:  power for CK,  LPDDR4/4X=0.6V/LPDDR5=0.5V
- VDDQ_CK：为CK（时钟）供电，LPDDR4/4X电压为0.6V
- 数据接口电源
- (near U8) VDDQ：为DDR的输入/输出接口供电（除CK、CKE和RESET外）；LPDDR4/4X电压为0.6V
- RK3588和DDR内存颗粒的I/O接口
- --------->
- DDR相关的辅助电路供电
- DDR Filter
- (in symbol SOC_RK3588, part A) DDR_PLL POWER; LP4/4X_CKE&LP5_CS & Reset Power; 0.75V-0.85V; 1.8V; LPDDR4/4X=1.1V / LPDDR5=1.05V; MEMORY INTERFACE POWER; CK Power; LPDDR4/4X=0.6V / LPDDR5=0.5V; DIGITAL CORE POWER; DDR IO POWER; (Except for ck, / cke and reset)
- (in symbol SOC_RK3588, part B) DDR_PLL POWER; LP4/4X_CKE&LP5_CS & Reset Power; 0.75V-0.85V; 1.8V; LPDDR4/4X=1.1V / LPDDR5=1.05V; MEMORY INTERFACE POWER; CK Power; LPDDR4/4X=0.6V / LPDDR5=0.5V; DIGITAL CORE POWER; DDR IO POWER; (Except for ck, / cke and reset)

### Library data of the parts
C185-C214 = C: 贴片电容/MLCC电容
R45-R48 = R: 贴片电阻
U8 = SOC_RK3588: ROCKCHIP SOC

## Sheet 8.RK3588_EMMCIO_VCCIO2.SchDoc
size A4; SheetNumber: 8; SheetTotal: 21
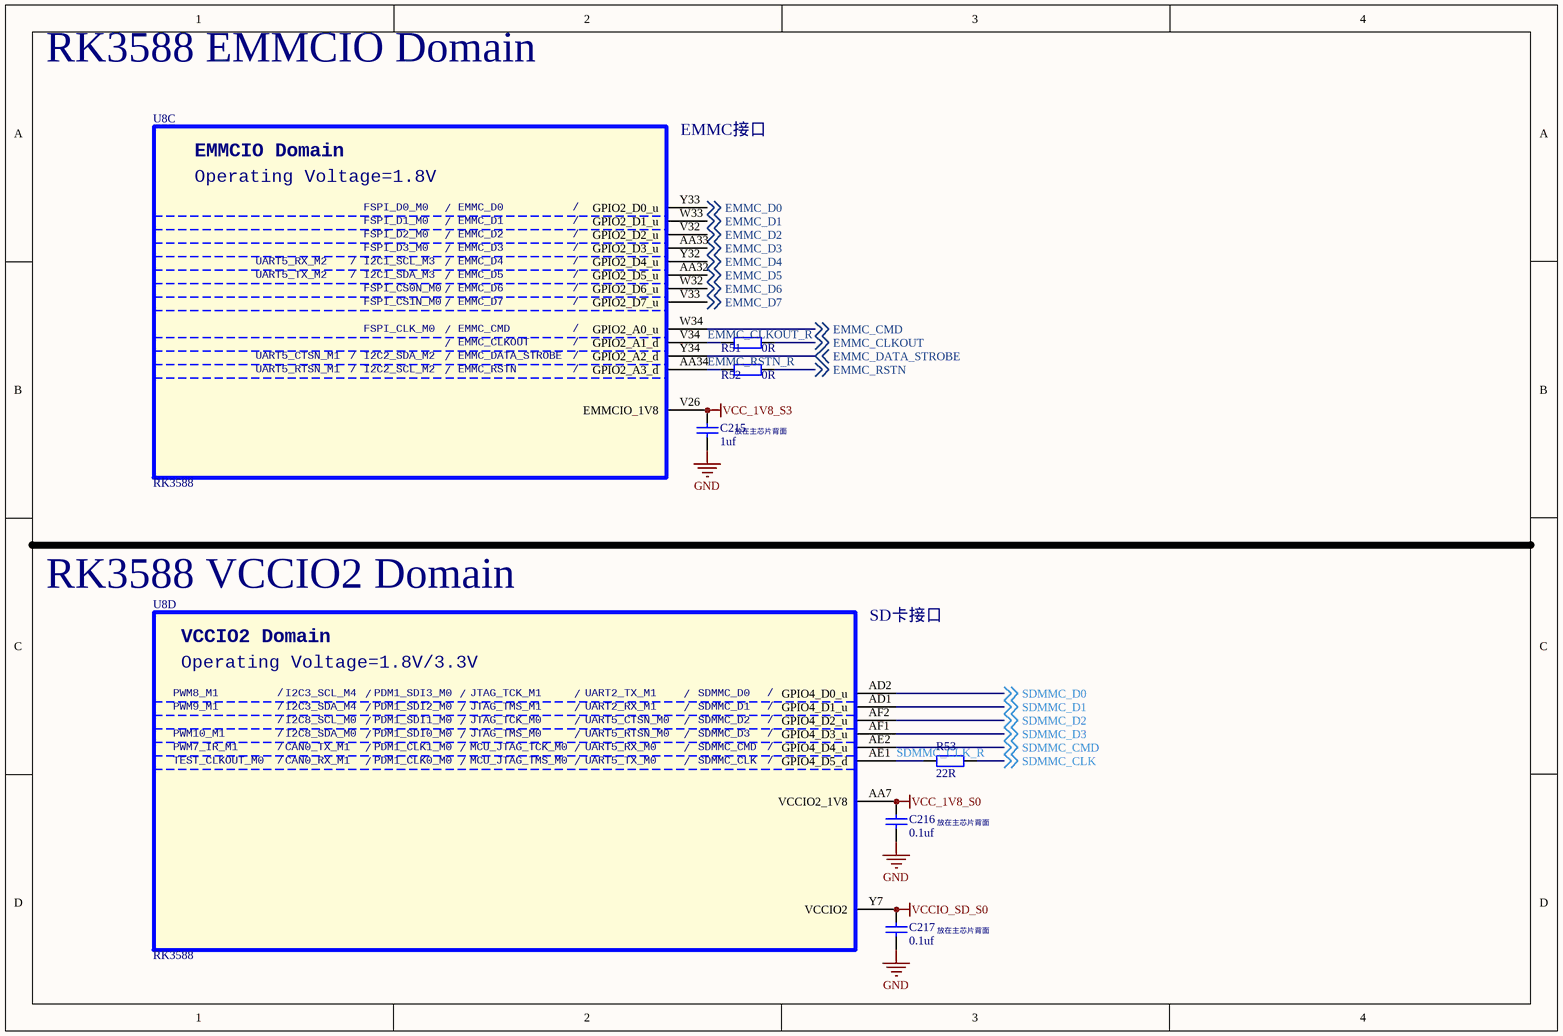
[diagram p7: 8.RK3588_EMMCIO_VCCIO2.SchDoc]

### Parts
C215  1uf  [C0201_L]
C216  0.1uf  [C0201_L]
C217  0.1uf  [C0201_L]
R51  0R  [R0201_L]
R52  0R  [R0201_L]
R53  22R  [R0402_L]
U8  RK3588  [BGA1088_23R00X23R00X2R00]  (parts C,D of 26)

### Nets
GND: C215.1 C216.1 C217.1
VCC_1V8_S0: C216.2 U8.AA7(VCCIO2_1V8)
VCC_1V8_S3: C215.2 U8.V26(EMMCIO_1V8)  [project net VCC1V8_PMU_DDR_S3]
VCCIO_SD_S0: C217.2 U8.Y7(VCCIO2)
EMMC_CLKOUT: R51.2 ; off-sheet EMMC_CLKOUT
EMMC_CLKOUT_R: R51.1 U8.V34(GPIO2_A1_d)
EMMC_CMD: U8.W34(GPIO2_A0_u) ; off-sheet EMMC_CMD  [project net FSPI_CLK_M0]
EMMC_D0: U8.Y33(GPIO2_D0_u) ; off-sheet EMMC_D0  [project net FSPI_D0_M0]
EMMC_D1: U8.W33(GPIO2_D1_u) ; off-sheet EMMC_D1  [project net FSPI_D1_M0]
EMMC_D2: U8.V32(GPIO2_D2_u) ; off-sheet EMMC_D2  [project net FSPI_D2_M0]
EMMC_D3: U8.AA33(GPIO2_D3_u) ; off-sheet EMMC_D3  [project net FSPI_D3_M0]
EMMC_D4: U8.Y32(GPIO2_D4_u) ; off-sheet EMMC_D4
EMMC_D5: U8.AA32(GPIO2_D5_u) ; off-sheet EMMC_D5
EMMC_D6: U8.W32(GPIO2_D6_u) ; off-sheet EMMC_D6  [project net FSPI_CS0N_M0]
EMMC_D7: U8.V33(GPIO2_D7_u) ; off-sheet EMMC_D7
EMMC_DATA_STROBE: U8.Y34(GPIO2_A2_d) ; off-sheet EMMC_DATA_STROBE
EMMC_RSTN: R52.2 ; off-sheet EMMC_RSTN
EMMC_RSTN_R: R52.1 U8.AA34(GPIO2_A3_d)
SDMMC_CLK: R53.2 ; off-sheet SDMMC_CLK
SDMMC_CLK_R: R53.1 U8.AE1(GPIO4_D5_d)
SDMMC_CMD: U8.AE2(GPIO4_D4_u) ; off-sheet SDMMC_CMD
SDMMC_D0: U8.AD2(GPIO4_D0_u) ; off-sheet SDMMC_D0
SDMMC_D1: U8.AD1(GPIO4_D1_u) ; off-sheet SDMMC_D1
SDMMC_D2: U8.AF2(GPIO4_D2_u) ; off-sheet SDMMC_D2
SDMMC_D3: U8.AF1(GPIO4_D3_u) ; off-sheet SDMMC_D3

### Notes on the sheet
- RK3588 EMMCIO Domain
- EMMC接口
- (near C215) 放在主芯片背面
- RK3588 VCCIO2 Domain
- SD卡接口
- 放在主芯片背面
- (near C217) 放在主芯片背面
- (in symbol SOC_RK3588, part C) EMMCIO Domain; Operating Voltage=1.8V; FSPI_D0_M0; /; EMMC_D0; FSPI_D1_M0; EMMC_D1; FSPI_D2_M0; EMMC_D2; FSPI_D3_M0; EMMC_D3; UART5_RX_M2; I2C1_SCL_M3; EMMC_D4; UART5_TX_M2; I2C1_SDA_M3; EMMC_D5; FSPI_CS0N_M0; EMMC_D6; FSPI_CS1N_M0; EMMC_D7; FSPI_CLK_M0; EMMC_CMD; EMMC_CLKOUT; UART5_CTSN_M1; I2C2_SDA_M2; EMMC_DATA_STROBE; UART5_RTSN_M1; I2C2_SCL_M2; EMMC_RSTN
- (in symbol SOC_RK3588, part D) VCCIO2 Domain; Operating Voltage=1.8V/3.3V; PWM8_M1; /; I2C3_SCL_M4; PDM1_SDI3_M0; JTAG_TCK_M1; UART2_TX_M1; SDMMC_D0; PWM9_M1; I2C3_SDA_M4; PDM1_SDI2_M0; JTAG_TMS_M1; UART2_RX_M1; SDMMC_D1; I2C8_SCL_M0; PDM1_SDI1_M0; JTAG_TCK_M0; UART5_CTSN_M0; SDMMC_D2; PWM10_M1; I2C8_SDA_M0; PDM1_SDI0_M0; JTAG_TMS_M0; UART5_RTSN_M0; SDMMC_D3; PWM7_IR_M1; CAN0_TX_M1; PDM1_CLK1_M0; MCU_JTAG_TCK_M0; UART5_RX_M0; SDMMC_CMD; TEST_CLKOUT_M0; CAN0_RX_M1; PDM1_CLK0_M0; MCU_JTAG_TMS_M0; UART5_TX_M0; SDMMC_CLK

### Library data of the parts
C215-C217 = C: 贴片电容/MLCC电容
R51-R53 = R: 贴片电阻
U8 = SOC_RK3588: ROCKCHIP SOC

## Sheet 9.RK3588_USB_Controler.SchDoc
size A3; SheetNumber: 9; SheetTotal: 21
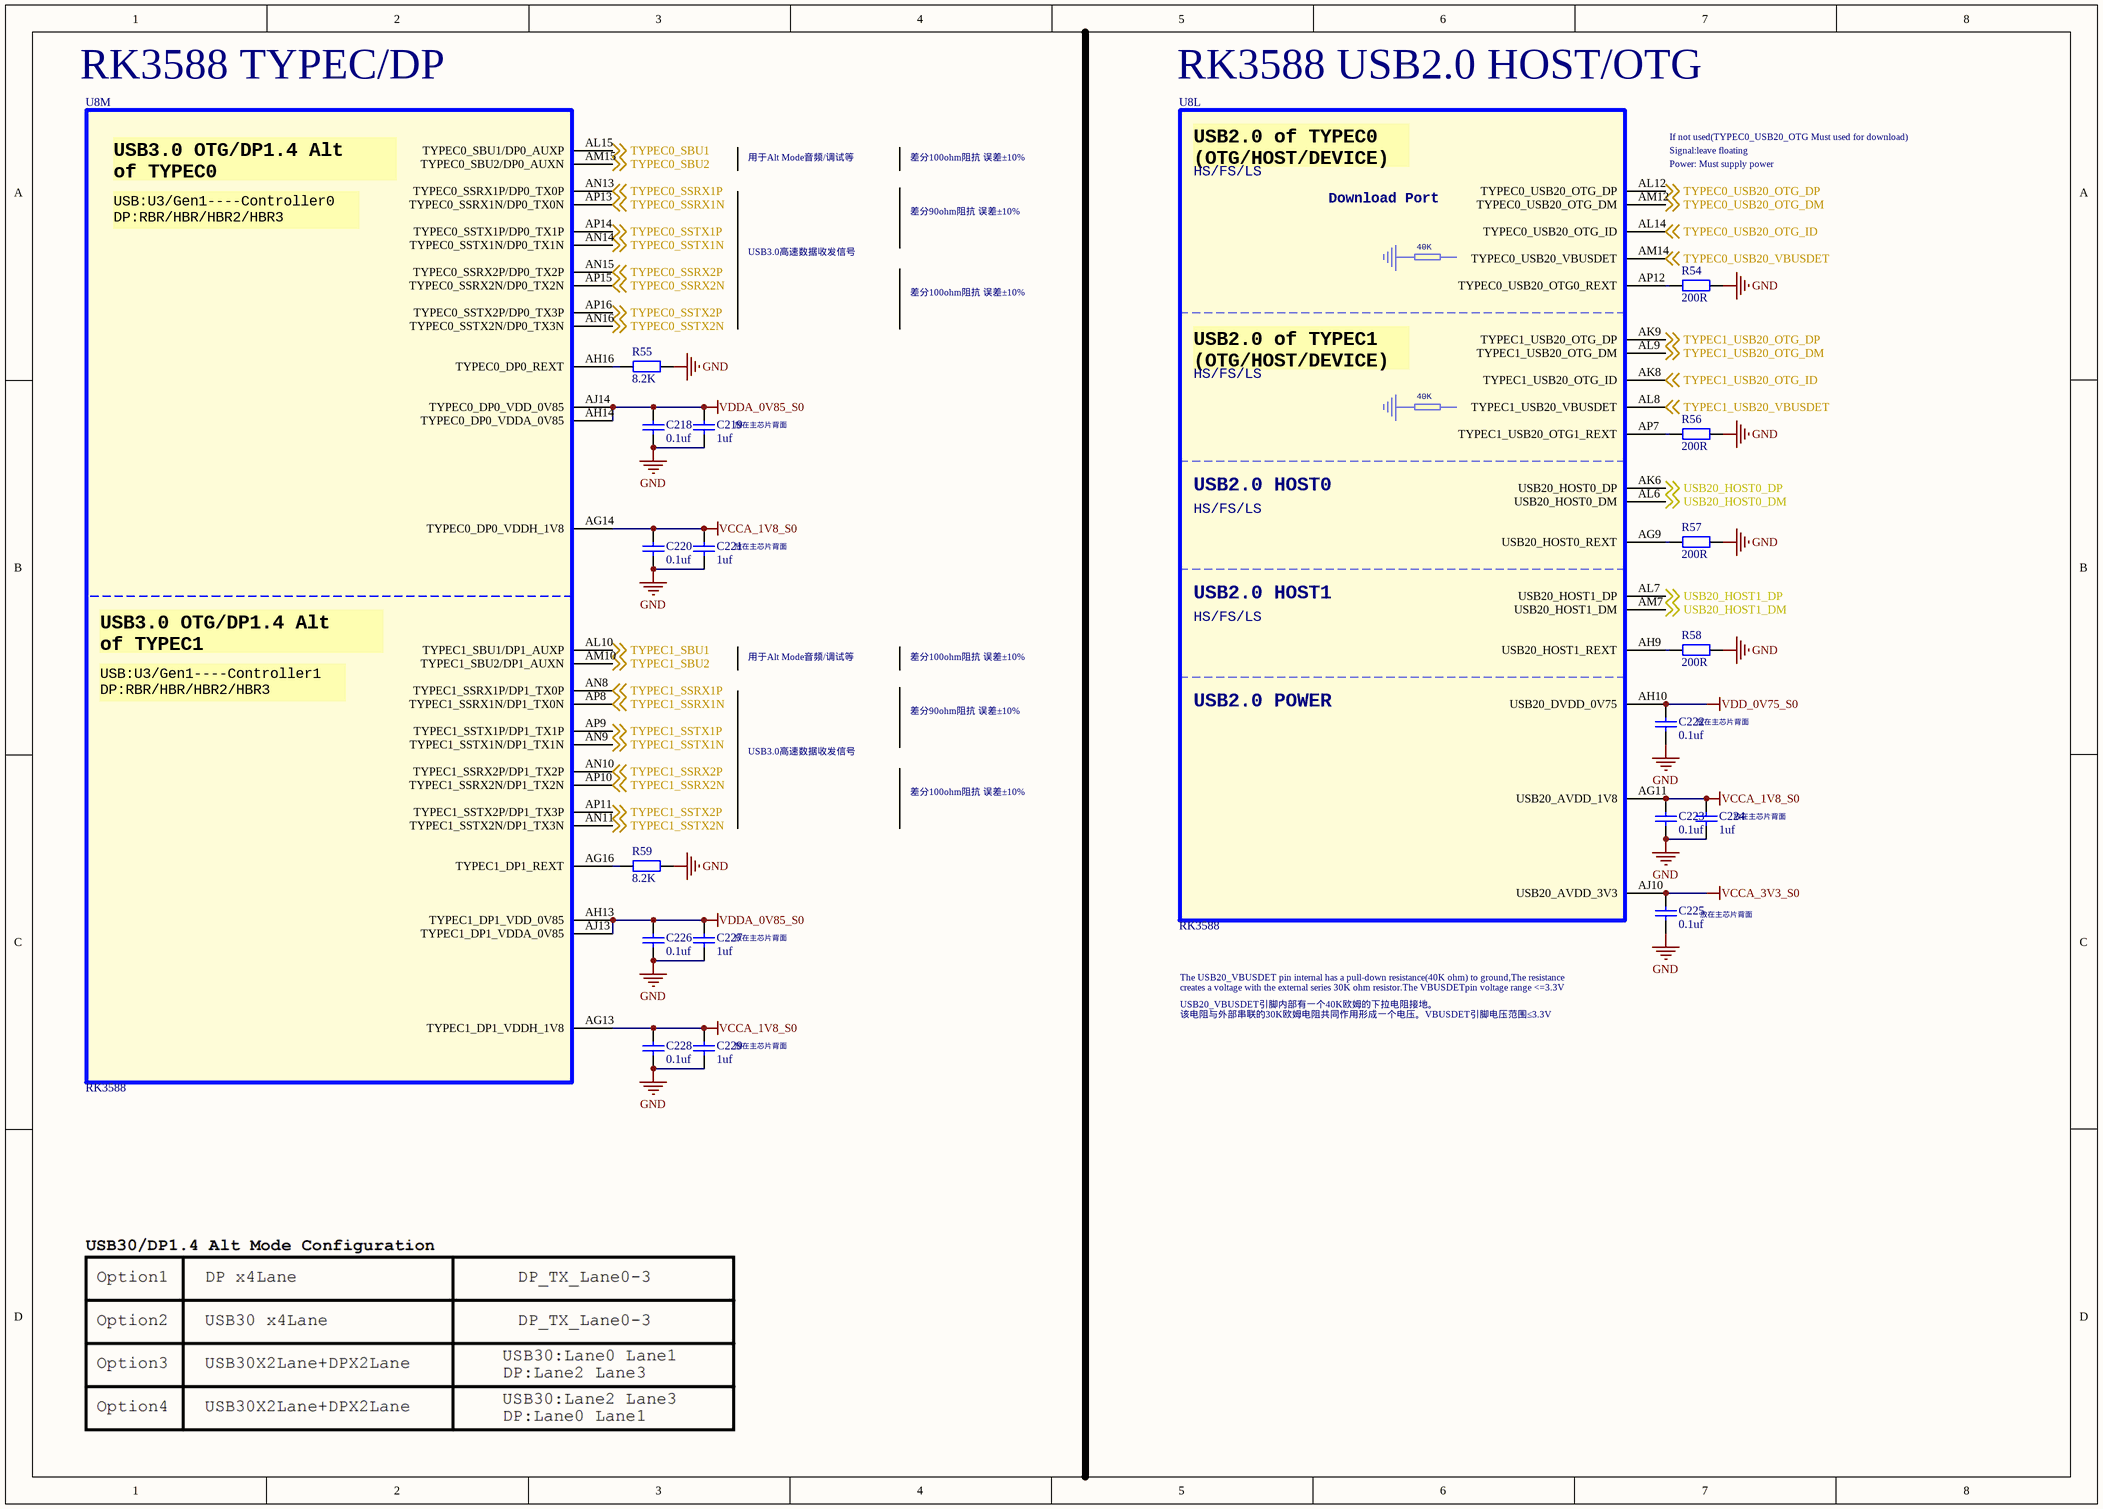
[diagram p8: 9.RK3588_USB_Controler.SchDoc]

### Parts
C218  0.1uf  [C0201_L]
C219  1uf  [C0201_L]
C220  0.1uf  [C0201_L]
C221  1uf  [C0201_L]
C222  0.1uf  [C0201_L]
C223  0.1uf  [C0201_L]
C224  1uf  [C0201_L]
C225  0.1uf  [C0201_L]
C226  0.1uf  [C0201_L]
C227  1uf  [C0201_L]
C228  0.1uf  [C0201_L]
C229  1uf  [C0201_L]
R54  200R  [R0201_L]
R55  8.2K  [R0201_L]
R56  200R  [R0201_L]
R57  200R  [R0201_L]
R58  200R  [R0201_L]
R59  8.2K  [R0201_L]
U8  RK3588  [BGA1088_23R00X23R00X2R00]  (parts L,M of 26)

### Nets
GND: C218.1 C219.1 C220.1 C221.1 C222.1 C223.1 C224.1 C225.1 C226.1 C227.1 C228.1 C229.1 R54.2 R55.2 R56.2 R57.2 R58.2 R59.2
VCCA_1V8_S0: C220.2 C221.2 C223.2 C224.2 C228.2 C229.2 U8.AG11(USB20_AVDD_1V8) U8.AG13(TYPEC1_DP1_VDDH_1V8) U8.AG14(TYPEC0_DP0_VDDH_1V8)  [project net AVDD1V8_DDR_PLL_S0]
VCCA_3V3_S0: C225.2 U8.AJ10(USB20_AVDD_3V3)
VDD_0V75_S0: C222.2 U8.AH10(USB20_DVDD_0V75)
VDDA_0V85_S0: C218.2 C219.2 C226.2 C227.2 U8.AH13(TYPEC1_DP1_VDD_0V85) U8.AH14(TYPEC0_DP0_VDDA_0V85) U8.AJ13(TYPEC1_DP1_VDDA_0V85) U8.AJ14(TYPEC0_DP0_VDD_0V85)
TYPEC0_SBU1: U8.AL15(TYPEC0_SBU1/DP0_AUXP) ; off-sheet TYPEC0_SBU1
TYPEC0_SBU2: U8.AM15(TYPEC0_SBU2/DP0_AUXN) ; off-sheet TYPEC0_SBU2
TYPEC0_SSRX1N: U8.AP13(TYPEC0_SSRX1N/DP0_TX0N) ; off-sheet TYPEC0_SSRX1N
TYPEC0_SSRX1P: U8.AN13(TYPEC0_SSRX1P/DP0_TX0P) ; off-sheet TYPEC0_SSRX1P
TYPEC0_SSRX2N: U8.AP15(TYPEC0_SSRX2N/DP0_TX2N) ; off-sheet TYPEC0_SSRX2N
TYPEC0_SSRX2P: U8.AN15(TYPEC0_SSRX2P/DP0_TX2P) ; off-sheet TYPEC0_SSRX2P
TYPEC0_SSTX1N: U8.AN14(TYPEC0_SSTX1N/DP0_TX1N) ; off-sheet TYPEC0_SSTX1N
TYPEC0_SSTX1P: U8.AP14(TYPEC0_SSTX1P/DP0_TX1P) ; off-sheet TYPEC0_SSTX1P
TYPEC0_SSTX2N: U8.AN16(TYPEC0_SSTX2N/DP0_TX3N) ; off-sheet TYPEC0_SSTX2N
TYPEC0_SSTX2P: U8.AP16(TYPEC0_SSTX2P/DP0_TX3P) ; off-sheet TYPEC0_SSTX2P
TYPEC0_USB20_OTG_DM: U8.AM12(TYPEC0_USB20_OTG_DM) ; off-sheet TYPEC0_USB20_OTG_DM
TYPEC0_USB20_OTG_DP: U8.AL12(TYPEC0_USB20_OTG_DP) ; off-sheet TYPEC0_USB20_OTG_DP
TYPEC0_USB20_OTG_ID: U8.AL14(TYPEC0_USB20_OTG_ID) ; off-sheet TYPEC0_USB20_OTG_ID
TYPEC0_USB20_VBUSDET: U8.AM14(TYPEC0_USB20_VBUSDET) ; off-sheet TYPEC0_USB20_VBUSDET
TYPEC1_SBU1: U8.AL10(TYPEC1_SBU1/DP1_AUXP) ; off-sheet TYPEC1_SBU1
TYPEC1_SBU2: U8.AM10(TYPEC1_SBU2/DP1_AUXN) ; off-sheet TYPEC1_SBU2
TYPEC1_SSRX1N: U8.AP8(TYPEC1_SSRX1N/DP1_TX0N) ; off-sheet TYPEC1_SSRX1N
TYPEC1_SSRX1P: U8.AN8(TYPEC1_SSRX1P/DP1_TX0P) ; off-sheet TYPEC1_SSRX1P
TYPEC1_SSRX2N: U8.AP10(TYPEC1_SSRX2N/DP1_TX2N) ; off-sheet TYPEC1_SSRX2N
TYPEC1_SSRX2P: U8.AN10(TYPEC1_SSRX2P/DP1_TX2P) ; off-sheet TYPEC1_SSRX2P
TYPEC1_SSTX1N: U8.AN9(TYPEC1_SSTX1N/DP1_TX1N) ; off-sheet TYPEC1_SSTX1N
TYPEC1_SSTX1P: U8.AP9(TYPEC1_SSTX1P/DP1_TX1P) ; off-sheet TYPEC1_SSTX1P
TYPEC1_SSTX2N: U8.AN11(TYPEC1_SSTX2N/DP1_TX3N) ; off-sheet TYPEC1_SSTX2N
TYPEC1_SSTX2P: U8.AP11(TYPEC1_SSTX2P/DP1_TX3P) ; off-sheet TYPEC1_SSTX2P
TYPEC1_USB20_OTG_DM: U8.AL9(TYPEC1_USB20_OTG_DM) ; off-sheet TYPEC1_USB20_OTG_DM
TYPEC1_USB20_OTG_DP: U8.AK9(TYPEC1_USB20_OTG_DP) ; off-sheet TYPEC1_USB20_OTG_DP
TYPEC1_USB20_OTG_ID: U8.AK8(TYPEC1_USB20_OTG_ID) ; off-sheet TYPEC1_USB20_OTG_ID
TYPEC1_USB20_VBUSDET: U8.AL8(TYPEC1_USB20_VBUSDET) ; off-sheet TYPEC1_USB20_VBUSDET
USB20_HOST0_DM: U8.AL6(USB20_HOST0_DM) ; off-sheet USB20_HOST0_DM
USB20_HOST0_DP: U8.AK6(USB20_HOST0_DP) ; off-sheet USB20_HOST0_DP
USB20_HOST1_DM: U8.AM7(USB20_HOST1_DM) ; off-sheet USB20_HOST1_DM
USB20_HOST1_DP: U8.AL7(USB20_HOST1_DP) ; off-sheet USB20_HOST1_DP
NetR54_1: R54.1 U8.AP12(TYPEC0_USB20_OTG0_REXT)
NetR55_1: R55.1 U8.AH16(TYPEC0_DP0_REXT)
NetR56_1: R56.1 U8.AP7(TYPEC1_USB20_OTG1_REXT)
NetR57_1: R57.1 U8.AG9(USB20_HOST0_REXT)
NetR58_1: R58.1 U8.AH9(USB20_HOST1_REXT)
NetR59_1: R59.1 U8.AG16(TYPEC1_DP1_REXT)

### Notes on the sheet
- RK3588 TYPEC/DP
- RK3588 USB2.0 HOST/OTG
- 用于Alt Mode音频/调试等
- 差分100ohm阻抗 误差±10%
- If not used(TYPEC0_USB20_OTG Must used for download)
- Signal:leave floating
- (near U8) Power: Must supply power
- 差分90ohm阻抗 误差±10%
- USB3.0高速数据收发信号
- (near C219) 放在主芯片背面
- (near C221) 放在主芯片背面
- (near C222) 放在主芯片背面
- (near C224) 放在主芯片背面
- (near C225) 放在主芯片背面
- (near C227) 放在主芯片背面
- The USB20_VBUSDET pin internal has a pull-down resistance(40K ohm) to ground,The resistance
- creates a voltage with the external series 30K ohm resistor.The VBUSDETpin voltage range <=3.3V
- (near C229) 放在主芯片背面
- USB20_VBUSDET引脚内部有一个40K欧姆的下拉电阻接地。
- 该电阻与外部串联的30K欧姆电阻共同作用形成一个电压。VBUSDET引脚电压范围≤3.3V
- (in symbol SOC_RK3588, part L) USB2.0 of TYPEC0 / (OTG/HOST/DEVICE); HS/FS/LS; Download Port; 40K; USB2.0 of TYPEC1 / (OTG/HOST/DEVICE); USB2.0 HOST0; USB2.0 HOST1; USB2.0 POWER
- (in symbol SOC_RK3588, part M) USB3.0 OTG/DP1.4 Alt / of TYPEC0; USB:U3/Gen1----Controller0 / DP:RBR/HBR/HBR2/HBR3; USB3.0 OTG/DP1.4 Alt / of TYPEC1; USB:U3/Gen1----Controller1 / DP:RBR/HBR/HBR2/HBR3

### Library data of the parts
C218-C229 = C: 贴片电容/MLCC电容
R54-R59 = R: 贴片电阻
U8 = SOC_RK3588: ROCKCHIP SOC